# Altium project Michel.PrjPcb (part 1 of 2)
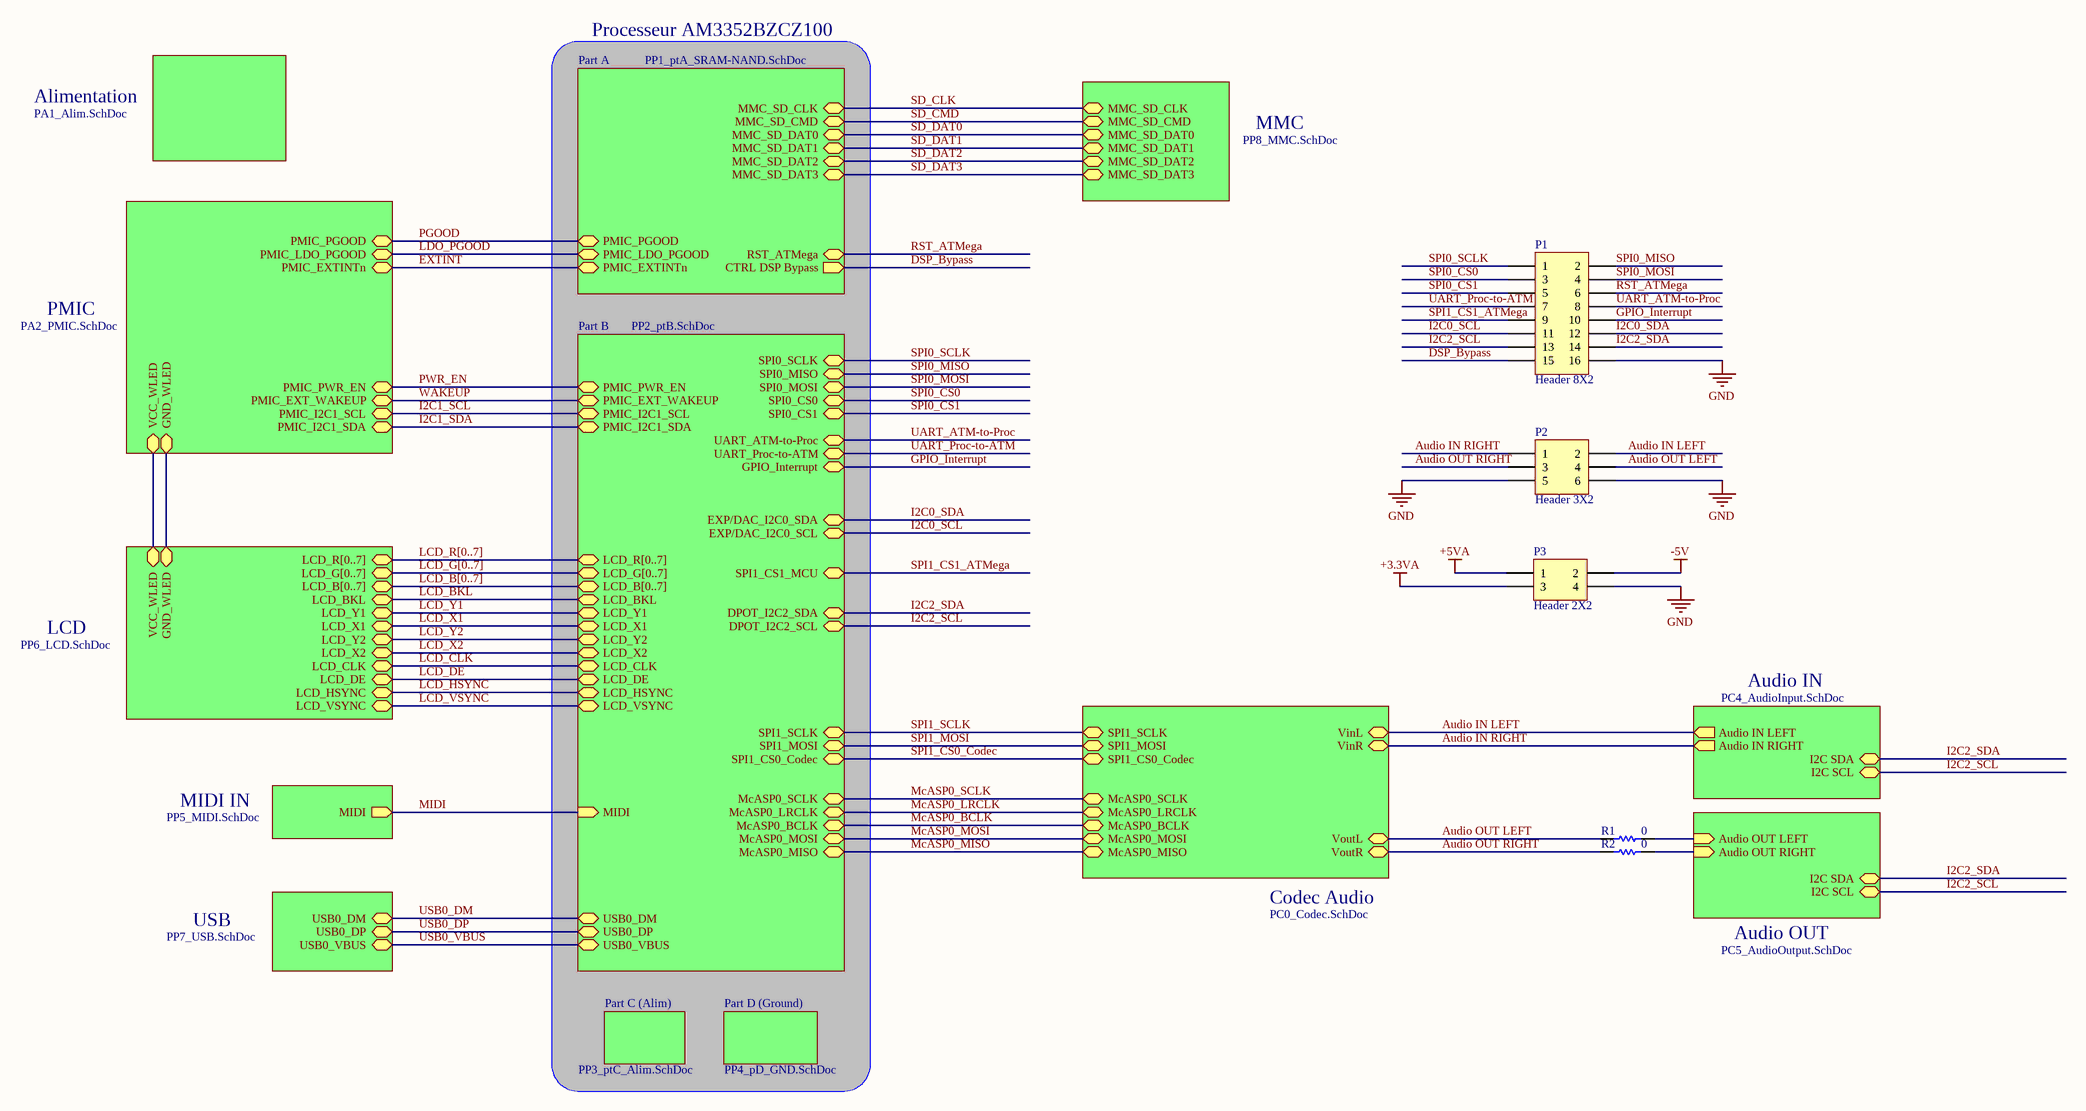
[diagram p0: P0_Main_Connect.SchDoc]
14 sheets, 392 parts. Net scope: hierarchical (ports join the sheet entries above them; power ports are global).
Board file: PCB.PcbDoc
Sheets:
  P0_Main_Connect.SchDoc
    Part A = PP1_ptA_SRAM-NAND.SchDoc
    Part B = PP2_ptB.SchDoc
    PMIC = PA2_PMIC.SchDoc
    LCD = PP6_LCD.SchDoc
    Part C (Alim) = PP3_ptC_Alim.SchDoc
    Alimentation = PA1_Alim.SchDoc
    Part D (Ground) = PP4_pD_GND.SchDoc
    MIDI IN = PP5_MIDI.SchDoc
    USB = PP7_USB.SchDoc
    MMC = PP8_MMC.SchDoc
    Audio IN = PC4_AudioInput.SchDoc
    Audio OUT = PC5_AudioOutput.SchDoc
    Codec Audio = PC0_Codec.SchDoc

## Sheet P0_Main_Connect.SchDoc
size A2

### Parts
P1  Header 8X2  [CONN_1241050-8_T]
P2  Header 3X2  [CONN_1241050-3_T]
P3  Header 2X2  [CONN_1241050-2_T]
R1  value 0  [RESC1608X05]  (hidden comment: Res 0 Ohm)
R2  value 0  [RESC1608X05]  (hidden comment: Res 0 Ohm)

### Sub-sheets
Alimentation = PA1_Alim.SchDoc: no entries
Audio IN = PC4_AudioInput.SchDoc: Audio IN RIGHT (out), Audio IN LEFT (out), I2C SCL, I2C SDA
Audio OUT = PC5_AudioOutput.SchDoc: Audio OUT RIGHT (in), Audio OUT LEFT (in), I2C SCL, I2C SDA
Codec Audio = PC0_Codec.SchDoc: SPI1_SCLK, SPI1_CS0_Codec, SPI1_MOSI, McASP0_LRCLK, McASP0_BCLK, McASP0_MOSI, McASP0_MISO, McASP0_SCLK, VoutL, VoutR, VinL, VinR
LCD = PP6_LCD.SchDoc: LCD_R[0..7], LCD_G[0..7], LCD_B[0..7], LCD_BKL, LCD_Y1, LCD_X1, LCD_Y2, LCD_X2, LCD_CLK, LCD_DE, LCD_HSYNC, LCD_VSYNC, GND_WLED, VCC_WLED
MIDI IN = PP5_MIDI.SchDoc: MIDI (out)
MMC = PP8_MMC.SchDoc: MMC_SD_CMD, MMC_SD_DAT0, MMC_SD_DAT1, MMC_SD_DAT2, MMC_SD_DAT3, MMC_SD_CLK
Part A = PP1_ptA_SRAM-NAND.SchDoc: CTRL DSP Bypass (out), RST_ATMega, MMC_SD_CLK, MMC_SD_CMD, MMC_SD_DAT0, MMC_SD_DAT1, MMC_SD_DAT2, MMC_SD_DAT3, PMIC_PGOOD, PMIC_LDO_PGOOD, PMIC_EXTINTn
Part B = PP2_ptB.SchDoc: MIDI (in), USB0_DM, USB0_DP, USB0_VBUS, SPI1_SCLK, SPI1_MOSI, SPI1_CS0_Codec, UART_ATM-to-Proc, UART_Proc-to-ATM, GPIO_Interrupt, SPI0_SCLK, SPI0_MISO, SPI0_MOSI, SPI0_CS0, SPI0_CS1, LCD_R[0..7], LCD_G[0..7], LCD_B[0..7], LCD_BKL, LCD_Y1, LCD_X1, LCD_Y2, LCD_X2, LCD_CLK, LCD_DE, LCD_HSYNC, LCD_VSYNC, PMIC_EXT_WAKEUP, PMIC_PWR_EN, PMIC_I2C1_SCL, PMIC_I2C1_SDA, SPI1_CS1_MCU, EXP/DAC_I2C0_SCL, EXP/DAC_I2C0_SDA, DPOT_I2C2_SDA, DPOT_I2C2_SCL, McASP0_LRCLK, McASP0_BCLK, McASP0_MOSI, McASP0_MISO, McASP0_SCLK
Part C (Alim) = PP3_ptC_Alim.SchDoc: no entries
Part D (Ground) = PP4_pD_GND.SchDoc: no entries
PMIC = PA2_PMIC.SchDoc: PMIC_EXT_WAKEUP, PMIC_PWR_EN, PMIC_I2C1_SCL, PMIC_I2C1_SDA, VCC_WLED, GND_WLED, PMIC_PGOOD, PMIC_LDO_PGOOD, PMIC_EXTINTn
USB = PP7_USB.SchDoc: USB0_VBUS, USB0_DP, USB0_DM

### Nets
+3.3VA: P3.3
+5VA: P3.1
-5V: P3.2
GND: P1.16 P2.5 P2.6 P3.4
Audio IN LEFT: P2.2 ; sheet Audio IN/Audio IN LEFT, sheet Codec Audio/VinL
Audio IN RIGHT: P2.1 ; sheet Audio IN/Audio IN RIGHT, sheet Codec Audio/VinR
Audio OUT LEFT: P2.4 R1.1 ; sheet Codec Audio/VoutL
Audio OUT RIGHT: P2.3 R2.1 ; sheet Codec Audio/VoutR
DSP_Bypass: P1.15 ; sheet Part A/CTRL DSP Bypass
EXTINT: sheet Part A/PMIC_EXTINTn, sheet PMIC/PMIC_EXTINTn
GPIO_Interrupt: P1.10 ; sheet Part B/GPIO_Interrupt
I2C0_SCL: P1.11 ; sheet Part B/EXP/DAC_I2C0_SCL
I2C0_SDA: P1.12 ; sheet Part B/EXP/DAC_I2C0_SDA
I2C1_SCL: sheet Part B/PMIC_I2C1_SCL, sheet PMIC/PMIC_I2C1_SCL
I2C1_SDA: sheet Part B/PMIC_I2C1_SDA, sheet PMIC/PMIC_I2C1_SDA
I2C2_SCL: P1.13 ; sheet Part B/DPOT_I2C2_SCL, sheet Audio IN/I2C SCL, sheet Audio OUT/I2C SCL
I2C2_SDA: P1.14 ; sheet Part B/DPOT_I2C2_SDA, sheet Audio IN/I2C SDA, sheet Audio OUT/I2C SDA
LCD_BKL: sheet Part B/LCD_BKL, sheet LCD/LCD_BKL
LCD_CLK: sheet Part B/LCD_CLK, sheet LCD/LCD_CLK
LCD_DE: sheet Part B/LCD_DE, sheet LCD/LCD_DE
LCD_HSYNC: sheet Part B/LCD_HSYNC, sheet LCD/LCD_HSYNC
LCD_VSYNC: sheet Part B/LCD_VSYNC, sheet LCD/LCD_VSYNC
LCD_X1: sheet Part B/LCD_X1, sheet LCD/LCD_X1
LCD_X2: sheet Part B/LCD_X2, sheet LCD/LCD_X2
LCD_Y1: sheet Part B/LCD_Y1, sheet LCD/LCD_Y1
LCD_Y2: sheet Part B/LCD_Y2, sheet LCD/LCD_Y2
LDO_PGOOD: sheet Part A/PMIC_LDO_PGOOD, sheet PMIC/PMIC_LDO_PGOOD
McASP0_BCLK: sheet Part B/McASP0_BCLK, sheet Codec Audio/McASP0_BCLK
McASP0_LRCLK: sheet Part B/McASP0_LRCLK, sheet Codec Audio/McASP0_LRCLK
McASP0_MISO: sheet Part B/McASP0_MISO, sheet Codec Audio/McASP0_MISO
McASP0_MOSI: sheet Part B/McASP0_MOSI, sheet Codec Audio/McASP0_MOSI
McASP0_SCLK: sheet Part B/McASP0_SCLK, sheet Codec Audio/McASP0_SCLK
MIDI: sheet Part B/MIDI, sheet MIDI IN/MIDI
PGOOD: sheet Part A/PMIC_PGOOD, sheet PMIC/PMIC_PGOOD
PWR_EN: sheet Part B/PMIC_PWR_EN, sheet PMIC/PMIC_PWR_EN
RST_ATMega: P1.6 ; sheet Part A/RST_ATMega
SD_CLK: sheet Part A/MMC_SD_CLK, sheet MMC/MMC_SD_CLK
SD_CMD: sheet Part A/MMC_SD_CMD, sheet MMC/MMC_SD_CMD
SD_DAT0: sheet Part A/MMC_SD_DAT0, sheet MMC/MMC_SD_DAT0
SD_DAT1: sheet Part A/MMC_SD_DAT1, sheet MMC/MMC_SD_DAT1
SD_DAT2: sheet Part A/MMC_SD_DAT2, sheet MMC/MMC_SD_DAT2
SD_DAT3: sheet Part A/MMC_SD_DAT3, sheet MMC/MMC_SD_DAT3
SPI0_CS0: P1.3 ; sheet Part B/SPI0_CS0
SPI0_CS1: P1.5 ; sheet Part B/SPI0_CS1
SPI0_MISO: P1.2 ; sheet Part B/SPI0_MISO
SPI0_MOSI: P1.4 ; sheet Part B/SPI0_MOSI
SPI0_SCLK: P1.1 ; sheet Part B/SPI0_SCLK
SPI1_CS0_Codec: sheet Part B/SPI1_CS0_Codec, sheet Codec Audio/SPI1_CS0_Codec
SPI1_CS1_ATMega: P1.9 ; sheet Part B/SPI1_CS1_MCU
SPI1_MOSI: sheet Part B/SPI1_MOSI, sheet Codec Audio/SPI1_MOSI
SPI1_SCLK: sheet Part B/SPI1_SCLK, sheet Codec Audio/SPI1_SCLK
UART_ATM-to-Proc: P1.8 ; sheet Part B/UART_ATM-to-Proc
UART_Proc-to-ATM: P1.7 ; sheet Part B/UART_Proc-to-ATM
USB0_DM: sheet Part B/USB0_DM, sheet USB/USB0_DM  [project net SB_N]
USB0_DP: sheet Part B/USB0_DP, sheet USB/USB0_DP  [project net SB_P]
USB0_VBUS: sheet Part B/USB0_VBUS, sheet USB/USB0_VBUS
WAKEUP: sheet Part B/PMIC_EXT_WAKEUP, sheet PMIC/PMIC_EXT_WAKEUP
NetC172_2: sheet PMIC/VCC_WLED, sheet LCD/VCC_WLED
NetC201_2: R2.2 ; sheet Audio OUT/Audio OUT RIGHT
NetC205_2: R1.2 ; sheet Audio OUT/Audio OUT LEFT
NetP8_1: sheet PMIC/GND_WLED, sheet LCD/GND_WLED

### Buses and harness runs
bus LCD_B[0..7] = sheet LCD/LCD_B[0..7] = sheet Part B/LCD_B[0..7]
bus LCD_G[0..7] = sheet LCD/LCD_G[0..7] = sheet Part B/LCD_G[0..7]
bus LCD_R[0..7] = sheet LCD/LCD_R[0..7] = sheet Part B/LCD_R[0..7]

### Notes on the sheet
- Processeur AM3352BZCZ100

### Library data of the parts
P1 = Header 8X2: Header, 8-Pin, Dual row; Fabricant: SAMTEC; Fournisseur: Farnell; RefFabricant: TSM-108-02-T-DV; RefFournisseur: 2856657; DataSheet: http://www.farnell.com/datasheets/318453.pdf
P2 = Header 3X2: Header, 3-Pin, Dual row; Fabricant: SAMTEC; Fournisseur: Farnell; RefFabricant: TSM-103-01-T-DV; RefFournisseur: 2505049; DataSheet: http://www.farnell.com/datasheets/318453.pdf
P3 = Header 2X2: Header, 2-Pin, Dual row; Fabricant: AMP - TE CONNECTIVITY; Fournisseur: Farnell; RefFabricant: 1241050-2; RefFournisseur: 9689559; DataSheet: http://www.farnell.com/datasheets/318453.pdf
R1 R2 = Res1: Resistor; Fabricant: VISHAY; Fournisseur: Farnell; RefFabricant: CRCW06030000Z0EB; RefFournisseur: 2616741; Case: 0603 [1608 Metric]

## Sheet PP1_ptA_SRAM-NAND.SchDoc
size 508 x 381 mm
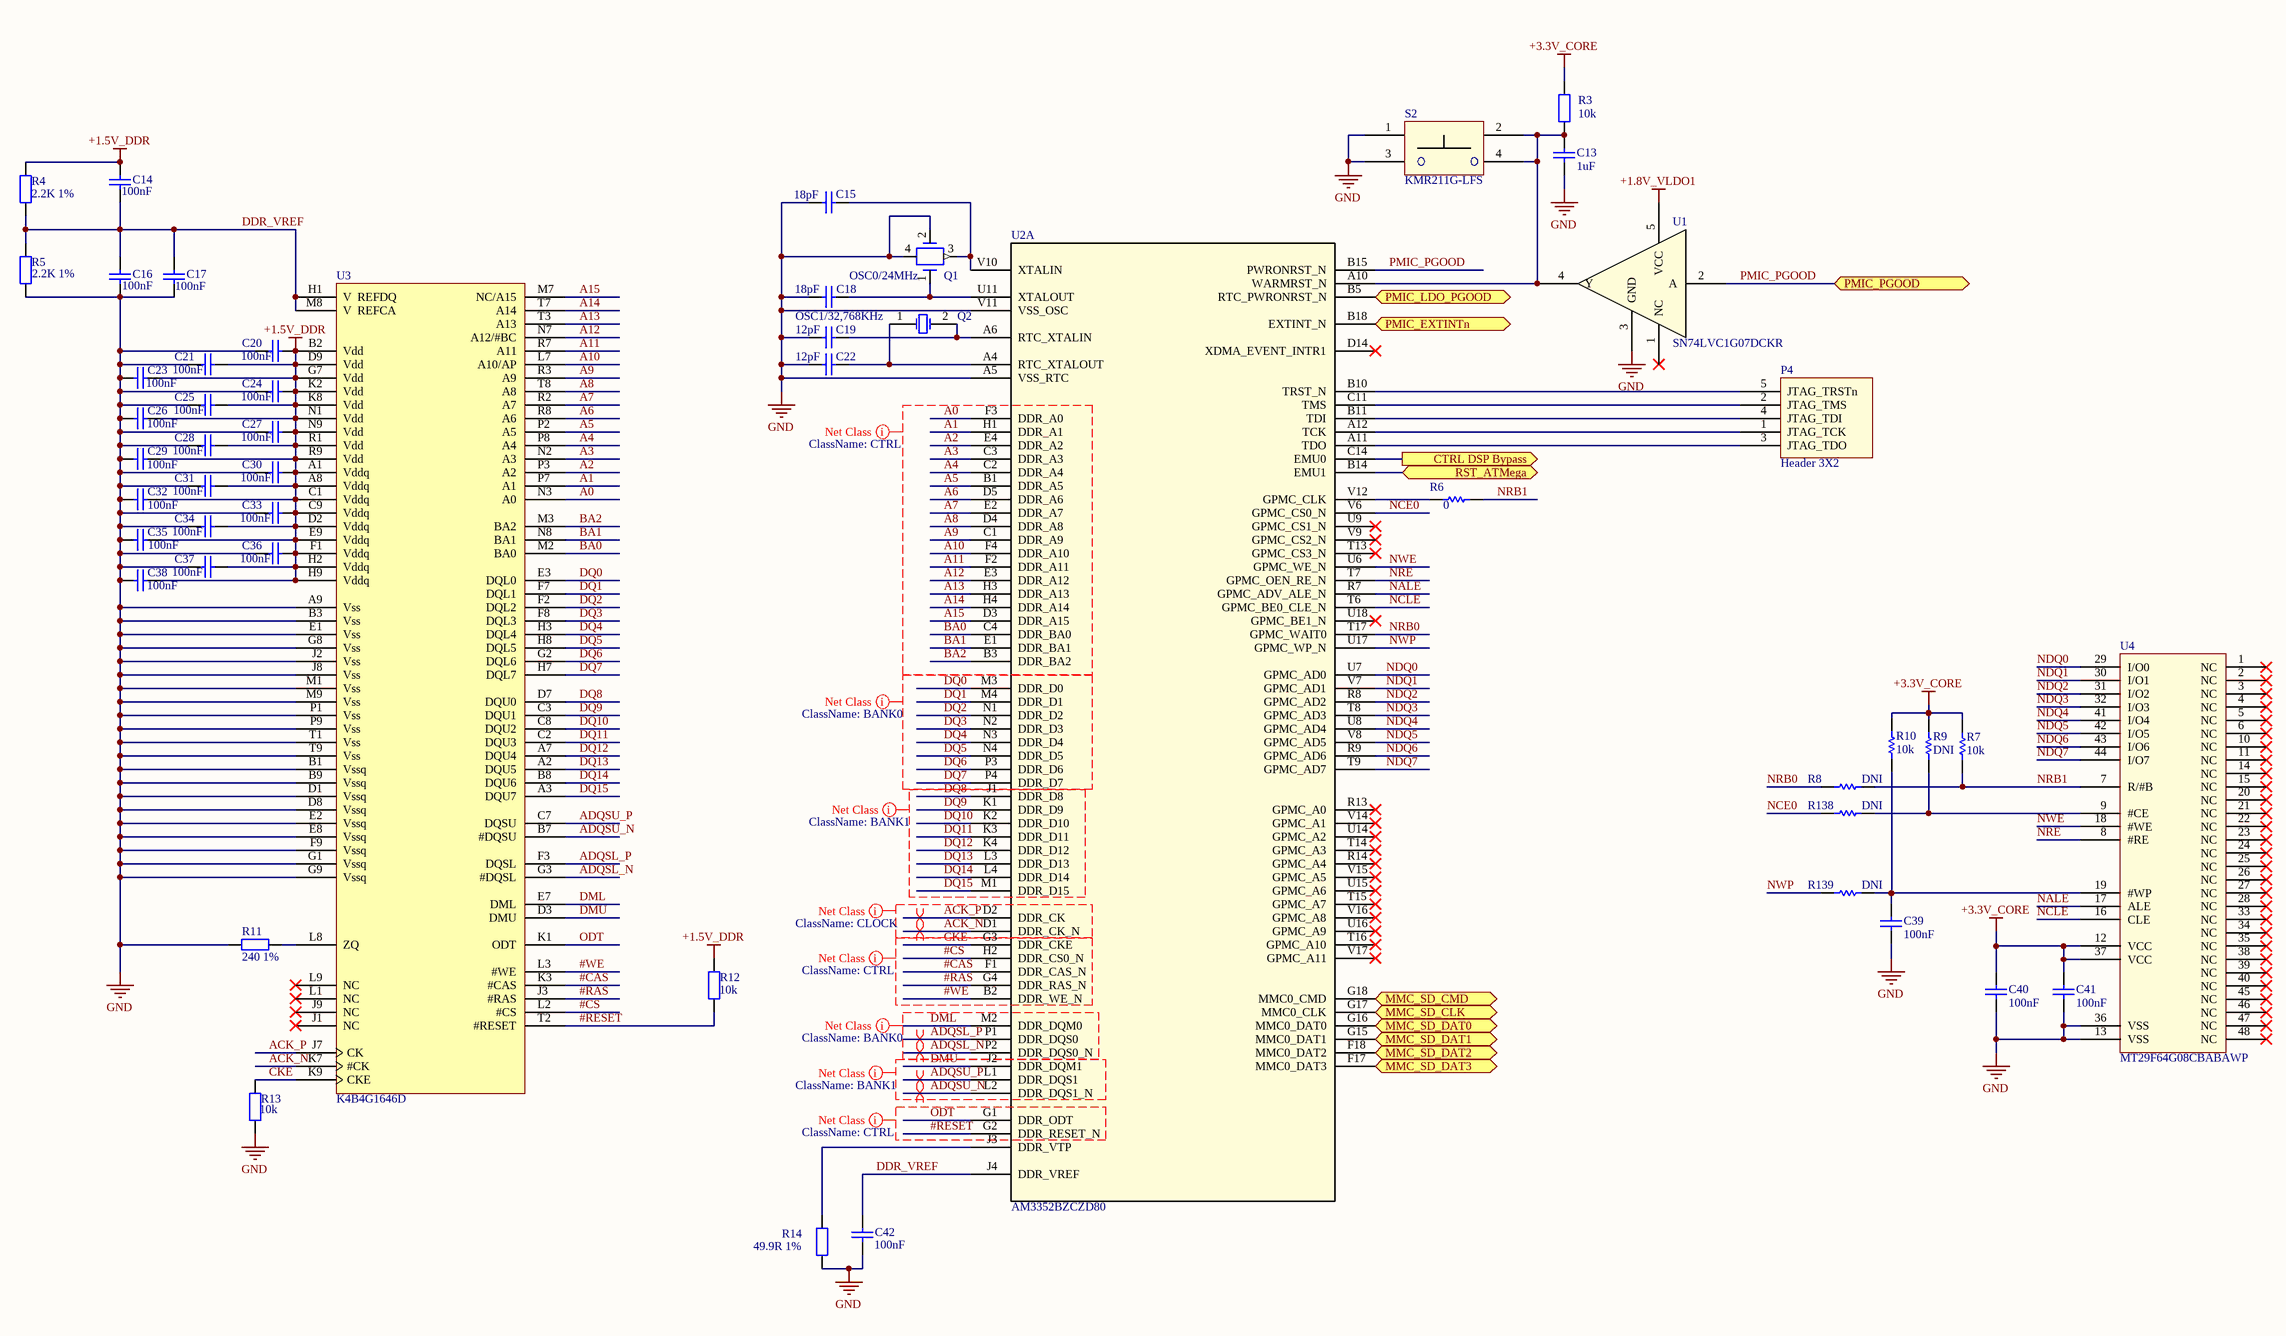
[diagram p1: PP1_ptA_SRAM-NAND.SchDoc]

### Parts
C13  value 1uF  [CAPC1608X08]  (hidden comment: Cap 1uF)
C14  value 100nF  [CAPC1005X05 (0402)]  (hidden comment: Cap 100nF)
C15  value 18pF  [CAPC1005X05 (0402)]  (hidden comment: Cap 18pF)
C16  value 100nF  [CAPC1005X05 (0402)]  (hidden comment: Cap 100nF)
C17  value 100nF  [CAPC1005X05 (0402)]  (hidden comment: Cap 100nF)
C18  value 18pF  [CAPC1005X05 (0402)]  (hidden comment: Cap 18pF)
C19  value 12pF  [CAPC1005X05 (0402)]  (hidden comment: Cap 12pF)
C20  value 100nF  [CAPC1005X05 (0402)]  (hidden comment: Cap 100nF)
C21  value 100nF  [CAPC1005X05 (0402)]  (hidden comment: Cap 100nF)
C22  value 12pF  [CAPC1005X05 (0402)]  (hidden comment: Cap 12pF)
C23  value 100nF  [CAPC1005X05 (0402)]  (hidden comment: Cap 100nF)
C24  value 100nF  [CAPC1005X05 (0402)]  (hidden comment: Cap 100nF)
C25  value 100nF  [CAPC1005X05 (0402)]  (hidden comment: Cap 100nF)
C26  value 100nF  [CAPC1005X05 (0402)]  (hidden comment: Cap 100nF)
C27  value 100nF  [CAPC1005X05 (0402)]  (hidden comment: Cap 100nF)
C28  value 100nF  [CAPC1005X05 (0402)]  (hidden comment: Cap 100nF)
C29  value 100nF  [CAPC1005X05 (0402)]  (hidden comment: Cap 100nF)
C30  value 100nF  [CAPC1005X05 (0402)]  (hidden comment: Cap 100nF)
C31  value 100nF  [CAPC1005X05 (0402)]  (hidden comment: Cap 100nF)
C32  value 100nF  [CAPC1005X05 (0402)]  (hidden comment: Cap 100nF)
C33  value 100nF  [CAPC1005X05 (0402)]  (hidden comment: Cap 100nF)
C34  value 100nF  [CAPC1005X05 (0402)]  (hidden comment: Cap 100nF)
C35  value 100nF  [CAPC1005X05 (0402)]  (hidden comment: Cap 100nF)
C36  value 100nF  [CAPC1005X05 (0402)]  (hidden comment: Cap 100nF)
C37  value 100nF  [CAPC1005X05 (0402)]  (hidden comment: Cap 100nF)
C38  value 100nF  [CAPC1005X05 (0402)]  (hidden comment: Cap 100nF)
C39  value 100nF  [CAPC1608X08]  (hidden comment: Cap 100nF)
C40  value 100nF  [CAPC1608X08]  (hidden comment: Cap 100nF)
C41  value 100nF  [CAPC1608X08]  (hidden comment: Cap 100nF)
C42  value 100nF  [CAPC1005X05 (0402)]  (hidden comment: Cap 100nF)
P4  Header 3X2  [CONN_1241050-3_T]
Q1  OSC0/24MHz  [SON440P360X120-4N]
Q2  OSC1/32,768KHz  [SON550P380X250-4N]
R3  value 10k  [RESC1608X05]  (hidden comment: Res 10k)
R4  value 2.2K 1%  [RESC1608X05]  (hidden comment: Res 2.2k)
R5  value 2.2K 1%  [RESC1608X05]  (hidden comment: Res 2.2k)
R6  value 0  [RESC1608X05]  (hidden comment: Res 0 Ohm)
R7  value 10k  [RESC1608X05]  (hidden comment: Res 10k)
R8  value DNI  [RESC1608X05]  (hidden comment: Res)  (no BOM)
R9  value DNI  [RESC1608X05]  (hidden comment: Res)  (no BOM)
R10  value 10k  [RESC1608X05]  (hidden comment: Res 10k)
R11  value 240 1%  [RESC1608X05]  (hidden comment: Res 240 1%)
R12  value 10k  [RESC1608X05]  (hidden comment: Res 10K)
R13  value 10k  [RESC1608X05]  (hidden comment: Res 10k)
R14  value 49.9R 1%  [RESC1608X05]  (hidden comment: Res 49.9R 1%)
R138  value DNI  [RESC1608X05]  (hidden comment: Res)  (no BOM)
R139  value DNI  [RESC1608X05]  (hidden comment: Res)  (no BOM)
S2  KMR211G-LFS  [C&K_KMR211G]
U1  SN74LVC1G07DCKR  [DCK5]
U2  AM3352BZCZD80  [ZCZ324]  (part A of 4)
U3  K4B4G1646D  [BGA96C80P16X6_133X75X11]
U4  MT29F64G08CBABAWP  [TSSOP50P2000X120-48N]

### Ports
CTRL DSP Bypass (out), MMC_SD_CLK, MMC_SD_CMD, MMC_SD_DAT0, MMC_SD_DAT1, MMC_SD_DAT2, MMC_SD_DAT3, PMIC_EXTINTn, PMIC_LDO_PGOOD, PMIC_PGOOD, RST_ATMega

### Nets
+1.5V_DDR: C14.2 C20.1 C21.1 C23.1 C24.1 C25.1 C26.1 C27.1 C28.1 C29.1 C30.1 C31.1 C32.1 C33.1 C34.1 C35.1 C36.1 C37.1 C38.1 R4.2 R12.2 U3.A1(Vddq) U3.A8(Vddq) U3.B2(Vdd) U3.C1(Vddq) U3.C9(Vddq) U3.D2(Vddq) U3.D9(Vdd) U3.E9(Vddq) U3.F1(Vddq) U3.G7(Vdd) U3.H2(Vddq) U3.H9(Vddq) U3.K2(Vdd) U3.K8(Vdd) U3.N1(Vdd) U3.N9(Vdd) U3.R1(Vdd) U3.R9(Vdd)
+1.8V_VLDO1: U1.5(VCC)
+3.3V_CORE: C40.2 C41.2 R3.2 R7.2 R9.2 R10.1 U4.12(VCC) U4.37(VCC)
GND: C13.1 C15.1 C16.1 C17.1 C18.1 C19.1 C20.2 C21.2 C22.1 C23.2 C24.2 C25.2 C26.2 C27.2 C28.2 C29.2 C30.2 C31.2 C32.2 C33.2 C34.2 C35.2 C36.2 C37.2 C38.2 C39.1 C40.1 C41.1 C42.2 Q1.2 Q1.4 R5.1 R11.2 R13.1 R14.1 S2.1 S2.3 U1.3(GND) U2.A5(VSS_RTC) U2.V11(VSS_OSC) U3.A9(Vss) U3.B1(Vssq) U3.B3(Vss) U3.B9(Vssq) U3.D1(Vssq) U3.D8(Vssq) U3.E1(Vss) U3.E2(Vssq) U3.E8(Vssq) U3.F9(Vssq) U3.G1(Vssq) U3.G8(Vss) U3.G9(Vssq) U3.J2(Vss) U3.J8(Vss) U3.M1(Vss) U3.M9(Vss) U3.P1(Vss) U3.P9(Vss) U3.T1(Vss) U3.T9(Vss) U4.13(VSS) U4.36(VSS)
#CAS: U2.F1(DDR_CAS_N) U3.K3(#CAS)
#CS: U2.H2(DDR_CS0_N) U3.L2(#CS)
#RAS: U2.G4(DDR_RAS_N) U3.J3(#RAS)
#RESET: R12.1 U2.G2(DDR_RESET_N) U3.T2(#RESET)
#WE: U2.B2(DDR_WE_N) U3.L3(#WE)
A0: U2.F3(DDR_A0) U3.N3(A0)
A1: U2.H1(DDR_A1) U3.P7(A1)
A2: U2.E4(DDR_A2) U3.P3(A2)
A3: U2.C3(DDR_A3) U3.N2(A3)
A4: U2.C2(DDR_A4) U3.P8(A4)
A5: U2.B1(DDR_A5) U3.P2(A5)
A6: U2.D5(DDR_A6) U3.R8(A6)
A7: U2.E2(DDR_A7) U3.R2(A7)
A8: U2.D4(DDR_A8) U3.T8(A8)
A9: U2.C1(DDR_A9) U3.R3(A9)
A10: U2.F4(DDR_A10) U3.L7(A10/AP)
A11: U2.F2(DDR_A11) U3.R7(A11)
A12: U2.E3(DDR_A12) U3.N7(A12/#BC)
A13: U2.H3(DDR_A13) U3.T3(A13)
A14: U2.H4(DDR_A14) U3.T7(A14)
A15: U2.D3(DDR_A15) U3.M7(NC/A15)
ACK_N: U2.D1(DDR_CK_N) U3.K7(#CK)
ACK_P: U2.D2(DDR_CK) U3.J7(CK)
ADQSL_N: U2.P2(DDR_DQS0_N) U3.G3(#DQSL)
ADQSL_P: U2.P1(DDR_DQS0) U3.F3(DQSL)
ADQSU_N: U2.L2(DDR_DQS1_N) U3.B7(#DQSU)
ADQSU_P: U2.L1(DDR_DQS1) U3.C7(DQSU)
BA0: U2.C4(DDR_BA0) U3.M2(BA0)
BA1: U2.E1(DDR_BA1) U3.N8(BA1)
BA2: U2.B3(DDR_BA2) U3.M3(BA2)
CKE: R13.2 U2.G3(DDR_CKE) U3.K9(CKE)
DDR_VREF: C14.1 C16.2 C17.2 C42.1 R4.1 R5.2 U2.J4(DDR_VREF) U3.H1(V__REFDQ) U3.M8(V__REFCA)
DML: U2.M2(DDR_DQM0) U3.E7(DML)
DMU: U2.J2(DDR_DQM1) U3.D3(DMU)
DQ0: U2.M3(DDR_D0) U3.E3(DQL0)
DQ1: U2.M4(DDR_D1) U3.F7(DQL1)
DQ2: U2.N1(DDR_D2) U3.F2(DQL2)
DQ3: U2.N2(DDR_D3) U3.F8(DQL3)
DQ4: U2.N3(DDR_D4) U3.H3(DQL4)
DQ5: U2.N4(DDR_D5) U3.H8(DQL5)
DQ6: U2.P3(DDR_D6) U3.G2(DQL6)
DQ7: U2.P4(DDR_D7) U3.H7(DQL7)
DQ8: U2.J1(DDR_D8) U3.D7(DQU0)
DQ9: U2.K1(DDR_D9) U3.C3(DQU1)
DQ10: U2.K2(DDR_D10) U3.C8(DQU2)
DQ11: U2.K3(DDR_D11) U3.C2(DQU3)
DQ12: U2.K4(DDR_D12) U3.A7(DQU4)
DQ13: U2.L3(DDR_D13) U3.A2(DQU5)
DQ14: U2.L4(DDR_D14) U3.B8(DQU6)
DQ15: U2.M1(DDR_D15) U3.A3(DQU7)
DSP_Bypass: U2.C14(EMU0) ; port CTRL DSP Bypass
EXTINT: U2.B18(EXTINT_N) ; port PMIC_EXTINTn
LDO_PGOOD: U2.B5(RTC_PWRONRST_N) ; port PMIC_LDO_PGOOD
NALE: U2.R7(GPMC_ADV_ALE_N) U4.17(ALE)
NCE0: R138.1 U2.V6(GPMC_CS0_N)
NCLE: U2.T6(GPMC_BE0_CLE_N) U4.16(CLE)
NDQ0: U2.U7(GPMC_AD0) U4.29(I/O0)
NDQ1: U2.V7(GPMC_AD1) U4.30(I/O1)
NDQ2: U2.R8(GPMC_AD2) U4.31(I/O2)
NDQ3: U2.T8(GPMC_AD3) U4.32(I/O3)
NDQ4: U2.U8(GPMC_AD4) U4.41(I/O4)
NDQ5: U2.V8(GPMC_AD5) U4.42(I/O5)
NDQ6: U2.R9(GPMC_AD6) U4.43(I/O6)
NDQ7: U2.T9(GPMC_AD7) U4.44(I/O7)
NRB0: R8.1 U2.T17(GPMC_WAIT0)
NRB1: R6.2 R7.1 R8.2 U4.7(R/#B)
NRE: U2.T7(GPMC_OEN_RE_N) U4.8(#RE)
NWE: U2.U6(GPMC_WE_N) U4.18(#WE)
NWP: R139.1 U2.U17(GPMC_WP_N)
ODT: U2.G1(DDR_ODT) U3.K1(ODT)
PMIC_PGOOD: U1.2(A) U2.B15(PWRONRST_N) ; port PMIC_PGOOD  [project net PGOOD]
RST_ATMega: U2.B14(EMU1) ; port RST_ATMega
SD_CLK: U2.G17(MMC0_CLK) ; port MMC_SD_CLK
SD_CMD: U2.G18(MMC0_CMD) ; port MMC_SD_CMD
SD_DAT0: U2.G16(MMC0_DAT0) ; port MMC_SD_DAT0
SD_DAT1: U2.G15(MMC0_DAT1) ; port MMC_SD_DAT1
SD_DAT2: U2.F18(MMC0_DAT2) ; port MMC_SD_DAT2
SD_DAT3: U2.F17(MMC0_DAT3) ; port MMC_SD_DAT3
NetC13_2: C13.2 R3.1 S2.2 S2.4 U1.4(Y) U2.A10(WARMRST_N)
NetC15_2: C15.2 Q1.3 U2.V10(XTALIN)
NetC18_2: C18.2 Q1.1 U2.U11(XTALOUT)
NetC19_2: C19.2 Q2.2(OSC2) U2.A6(RTC_XTALIN)
NetC22_2: C22.2 Q2.1(OSC1) U2.A4(RTC_XTALOUT)
NetC39_2: C39.2 R10.2 R139.2 U4.19(#WP)
NetP4_1: P4.1(JTAG_TCK) U2.A12(TCK)
NetP4_2: P4.2(JTAG_TMS) U2.C11(TMS)
NetP4_3: P4.3(JTAG_TDO) U2.A11(TDO)
NetP4_4: P4.4(JTAG_TDI) U2.B11(TDI)
NetP4_5: P4.5(JTAG_TRSTn) U2.B10(TRST_N)
NetR6_1: R6.1 U2.V12(GPMC_CLK)
NetR9_1: R9.1 R138.2 U4.9(#CE)
NetR11_1: R11.1 U3.L8(ZQ)
NetR14_2: R14.2 U2.J3(DDR_VTP)

Not connected (* = marked no-connect by the designer): U1 1(NC)*; U2 D14(XDMA_EVENT_INTR1)* R13(GPMC_A0)* R14(GPMC_A4)* T13(GPMC_CS3_N)* T14(GPMC_A3)* T15(GPMC_A7)* T16(GPMC_A10)* U9(GPMC_CS1_N)* U14(GPMC_A2)* U15(GPMC_A6)* U16(GPMC_A9)* U18(GPMC_BE1_N)* V9(GPMC_CS2_N)* V14(GPMC_A1)* V15(GPMC_A5)* V16(GPMC_A8)* V17(GPMC_A11)*; U3 J1(NC)* J9(NC)* L1(NC)* L9(NC)*; U4 1(NC)* 2(NC)* 3(NC)* 4(NC)* 5(NC)* 6(NC)* 10(NC)* 11(NC)* 14(NC)* 15(NC)* 20(NC)* 21(NC)* 22(NC)* 23(NC)* 24(NC)* 25(NC)* 26(NC)* 27(NC)* 28(NC)* 33(NC)* 34(NC)* 35(NC)* 38(NC)* 39(NC)* 40(NC)* 45(NC)* 46(NC)* 47(NC)* 48(NC)*

### Layout directives
differential pair; net class DIFF100: ACK_N, ACK_P, ADQSL_N, ADQSL_P, ADQSU_N, ADQSU_P
net class CTRL: #CAS, #CS, #RAS, #RESET, #WE, A0, A1, A2, A3, A4, A5, A6, A7, A8, A9, A10, A11, A12, A13, A14, A15, BA0, BA1, BA2, CKE, ODT
net class BANK0: DML, DQ0, DQ1, DQ2, DQ3, DQ4, DQ5, DQ6, DQ7
net class CLOCK: ACK_N, ACK_P
net class BANK1: ADQSU_N, ADQSU_P, DMU, DQ8, DQ9, DQ10, DQ11, DQ12, DQ13, DQ14, DQ15

### Notes on the sheet
- Title
- Size:
- Date:
- A3
- Number:
- Time:
- Revision:
- Sheet
- of
- File:

### Library data of the parts
C13 = Cap: Capacitor; Fabricant: MURATA; Fournisseur: Farnell; RefFabricant: GRM188F51A105ZA01D; RefFournisseur: 1828847; Case: 0603 [1608 Metric]; DataSheet: http://www.farnell.com/datasheets/2048756.pdf
C14 C16 C17 C20 C21 C23-C38 C42 = Cap: Capacitor; Fabricant: MULTICOMP; Fournisseur: Farnell; RefFabricant: MC0402N101J160CT; RefFournisseur: 2627387; Case: 0402 [1005 Metric]; DataSheet: http://www.farnell.com/datasheets/2117933.pdf
C15 C18 = Cap: Capacitor; Fabricant: MURATA; Fournisseur: Farnell; RefFabricant: GRM1555C1H180FA01D; RefFournisseur: 2611892; Case: 0402 [1005 Metric]; DataSheet: http://www.farnell.com/datasheets/2048029.pdf
C19 C22 = Cap: Capacitor; Fabricant: MURATA; Fournisseur: Farnell; RefFabricant: GRM1555C1H120FA01D; RefFournisseur: 2611890; Case: 0402 [1005 Metric]; DataSheet: http://www.farnell.com/datasheets/2079134.pdf
C39-C41 = Cap Semi: Capacitor; Fabricant: KEMET; Fournisseur: Farnell; RefFabricant: C0603T104K5RALTU; RefFournisseur: 2522432; Case: 0603 [1608 Metric]
P4 = JTAG: Header, 3-Pin, Dual row; Fournisseur: Farnell; RefFournisseur: 2505049; Fabricant: SAMTEC; RefFabricant: TSM-103-01-T-DV; DataSheet: http://www.farnell.com/datasheets/318453.pdf
Q1 = CRYS_32_768KHz_CMS32: Quartz 24MHz; RefFournisseur: 2467855; Fournisseur: Farnell; Fabricant: ABRACON; RefFabricant: ABMM2-24.000MHZ-E2-T; DataSheet: http://www.farnell.com/datasheets/1750519.pdf; Value: 24MHz
Q2 = XTAL: Crystal Oscillator; Fabricant: IQD FREQUENCY PRODUCTS; Fournisseur: Farnell; RefFabricant: LFXTAL003000; RefFournisseur: 9713220; Value: 32,768KHz; DataSheet: http://www.farnell.com/datasheets/2175893.pdf
R3 R12 R13 = Res2: Resistor; Fabricant: TE CONNECTIVITY; Fournisseur: Farnell; RefFabricant: CRGH0603J10K; RefFournisseur: 2331740; Case: 0603 [1608 Metric]; DataSheet: CRGH0603J10K
R4 R5 = Res2: Resistor; Fabricant: TE CONNECTIVITY; Fournisseur: Farnell; RefFabricant: CRGH0603F2K2; RefFournisseur: 2332007; Case: 0603 [1608 Metric]
R6 = Res1: as R1 on sheet P0_Main_Connect; Case: 0603 [1608 Metric]
R7 R10 = Res1: Resistor; Fabricant: TE CONNECTIVITY; Fournisseur: Farnell; RefFabricant: CRGH0603J10K; RefFournisseur: 2331740; Case: 0603 [1608 Metric]; DataSheet: CRGH0603J10K
R8 R9 R138 R139 = Res1: Resistor; Case: 0603 [1608 Metric]
R11 = Res2: Resistor; Fabricant: TE CONNECTIVITY; Fournisseur: Farnell; RefFabricant: CPF0603B240RE1; RefFournisseur: 2331060; Case: 0603 [1608 Metric]
R14 = Res2: Resistor; Fabricant: TE CONNECTIVITY; Fournisseur: Farnell; RefFabricant: RN73C1J49R9BTDF; RefFournisseur: 2613729; Case: 0603 [1608 Metric]
S2 = KMR211G-LFS: Commutateur tactile; Fournisseur: Farnell; RefFournisseur: 1437635; RefFabricant: KMR211G LFS; Fabricant: C & K COMPONENTS; DataSheet: http://www.farnell.com/datasheets/2044619.pdf
U1 = SN74LVC1G07DCKR: Buffers & Transmetteurs; RefFournisseur: 1287544; Fabricant: TEXAS INSTRUMENTS; Fournisseur: Farnell; RefFabricant: SN74LVC1G07DCKR; DataSheet: http://www.ti.com/lit/ds/symlink/sn74lvc1g07.pdf
U2 = AM3352BZCZD80: Microprocesseur ARM; Fabricant: TEXAS INSTRUMENTS; Fournisseur: Olimex; RefFabricant: AM3352ZCZD72; RefFournisseur: AM3352ZCZD72; DataSheet: http://www.ti.com/lit/ds/symlink/am3352.pdf
U3 = K4B4G1646D: Mémoire DDR3/SRAM; Fabricant: Samsung; Fournisseur: Olimex; RefFabricant: DS_K4B4G1646D; RefFournisseur: K4B4G1646D-BCK0; DataSheet: http://www.samsung.com/global/business/semiconductor/file/product/DS_K4B4G1646D-BC_I_P_Rev102.pdf
U4 = MT29F64G08CBABAWP: Mémoire Flash/NAND; Fournisseur: Olimex; Fabricant: Hynix; RefFabricant: MT29F64G08CBABAWP; RefFournisseur: MT29F64G08CBABAWP; DataSheet: https://www.olimex.com/Products/Components/IC/H27UBG8T2BTR/resources/H27UBG8T2BTR.pdf

## Sheet PP2_ptB.SchDoc
size 254 x 254 mm
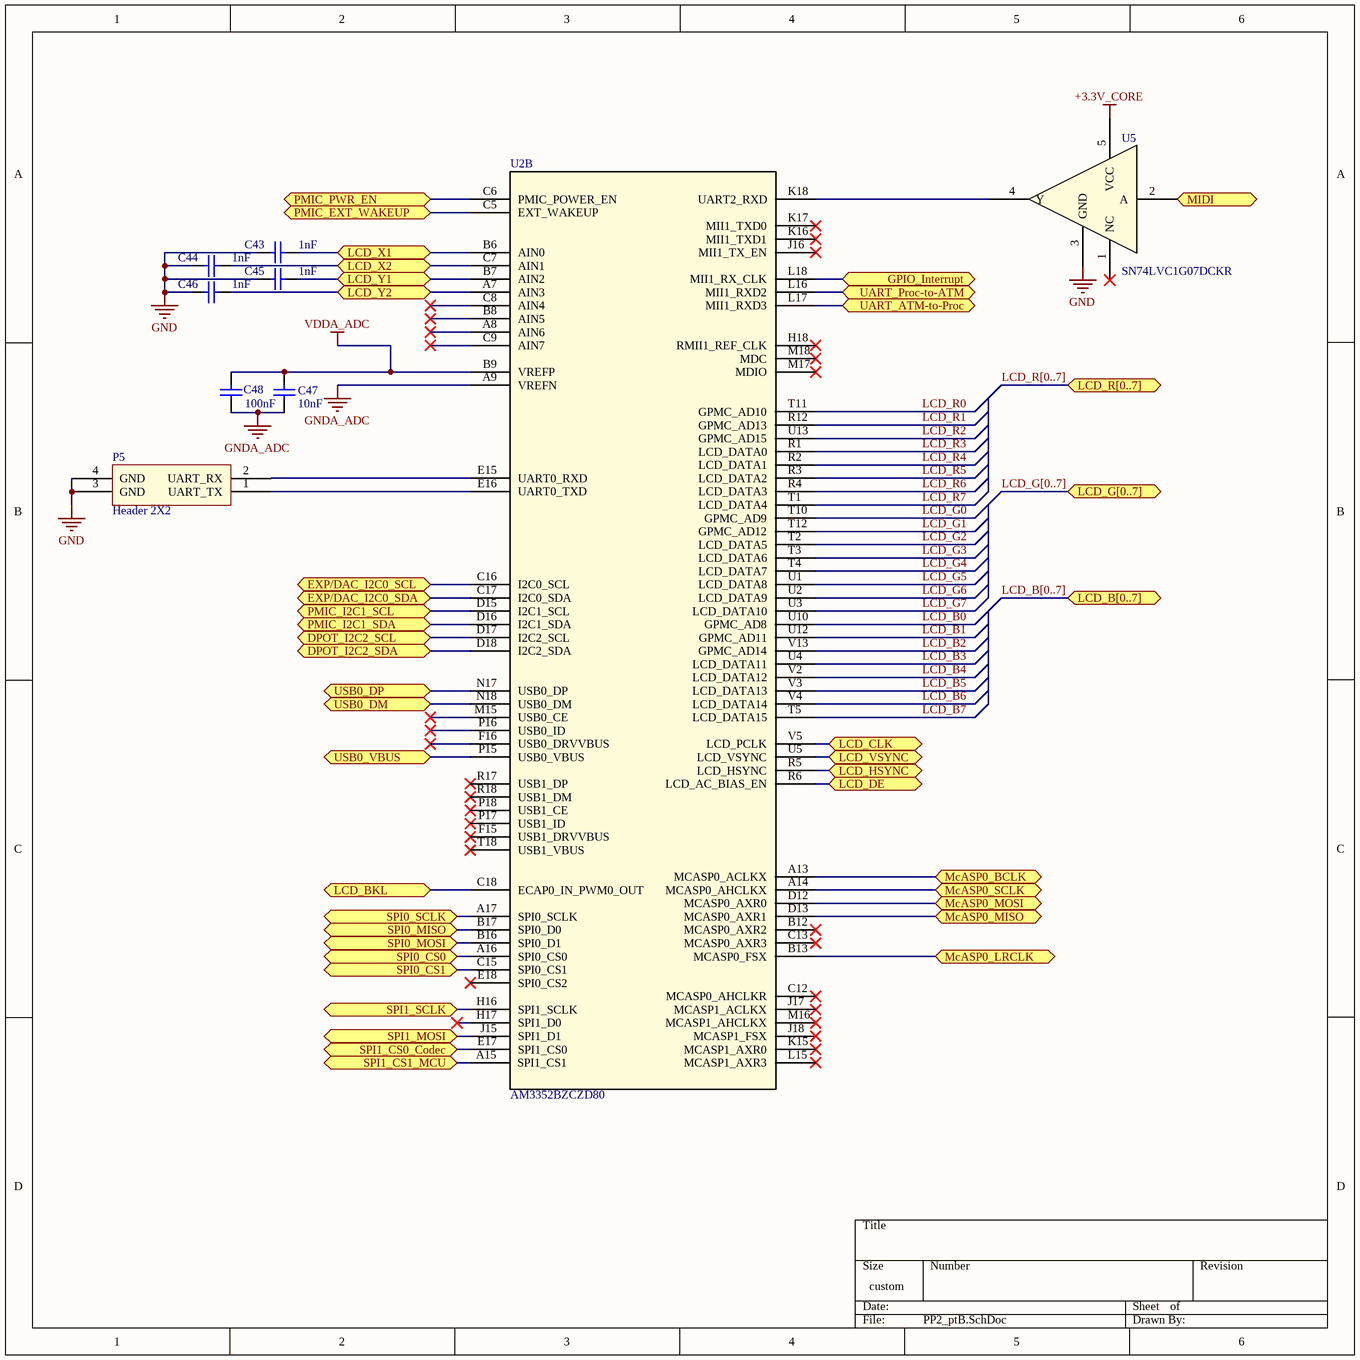
[diagram p2: PP2_ptB.SchDoc]

### Parts
C43  value 1nF  [CAPC1608X08]  (hidden comment: Cap 1nF)
C44  value 1nF  [CAPC1608X08]  (hidden comment: Cap 1nF)
C45  value 1nF  [CAPC1608X08]  (hidden comment: Cap 1nF)
C46  value 1nF  [CAPC1608X08]  (hidden comment: Cap 1nF)
C47  value 10nF  [CAPC1005X05 (0402)]  (hidden comment: Cap 10uF)
C48  value 100nF  [CAPC1005X05 (0402)]  (hidden comment: Cap 100nF)
P5  Header 2X2  [CONN_1241050-2_T]
U2  AM3352BZCZD80  [ZCZ324]  (part B of 4)
U5  SN74LVC1G07DCKR  [DCK5]

### Ports
DPOT_I2C2_SCL, DPOT_I2C2_SDA, EXP/DAC_I2C0_SCL, EXP/DAC_I2C0_SDA, GPIO_Interrupt, LCD_B[0..7], LCD_BKL, LCD_CLK, LCD_DE, LCD_G[0..7], LCD_HSYNC, LCD_R[0..7], LCD_VSYNC, LCD_X1, LCD_X2, LCD_Y1, LCD_Y2, McASP0_BCLK, McASP0_LRCLK, McASP0_MISO, McASP0_MOSI, McASP0_SCLK, MIDI (in), PMIC_EXT_WAKEUP, PMIC_I2C1_SCL, PMIC_I2C1_SDA, PMIC_PWR_EN, SPI0_CS0, SPI0_CS1, SPI0_MISO, SPI0_MOSI, SPI0_SCLK, SPI1_CS0_Codec, SPI1_CS1_MCU, SPI1_MOSI, SPI1_SCLK, UART_ATM-to-Proc, UART_Proc-to-ATM, USB0_DM, USB0_DP, USB0_VBUS

### Nets
+3.3V_CORE: U5.5(VCC)
GND: C43.1 C44.1 C45.1 C46.1 P5.3(GND) P5.4(GND) U5.3(GND)
GNDA_ADC: C47.2 C48.2 U2.A9(VREFN)
VDDA_ADC: C47.1 C48.1 U2.B9(VREFP)
GPIO_Interrupt: U2.L18(MII1_RX_CLK) ; port GPIO_Interrupt
I2C0_SCL: U2.C16(I2C0_SCL) ; port EXP/DAC_I2C0_SCL
I2C0_SDA: U2.C17(I2C0_SDA) ; port EXP/DAC_I2C0_SDA
I2C1_SCL: U2.D15(I2C1_SCL) ; port PMIC_I2C1_SCL
I2C1_SDA: U2.D16(I2C1_SDA) ; port PMIC_I2C1_SDA
I2C2_SCL: U2.D17(I2C2_SCL) ; port DPOT_I2C2_SCL
I2C2_SDA: U2.D18(I2C2_SDA) ; port DPOT_I2C2_SDA
LCD_B0: U2.U10(GPMC_AD8)
LCD_B1: U2.U12(GPMC_AD11)
LCD_B2: U2.V13(GPMC_AD14)
LCD_B3: U2.U4(LCD_DATA11)
LCD_B4: U2.V2(LCD_DATA12)
LCD_B5: U2.V3(LCD_DATA13)
LCD_B6: U2.V4(LCD_DATA14)
LCD_B7: U2.T5(LCD_DATA15)
LCD_BKL: U2.C18(ECAP0_IN_PWM0_OUT) ; port LCD_BKL
LCD_CLK: U2.V5(LCD_PCLK) ; port LCD_CLK
LCD_DE: U2.R6(LCD_AC_BIAS_EN) ; port LCD_DE
LCD_G0: U2.T10(GPMC_AD9)
LCD_G1: U2.T12(GPMC_AD12)
LCD_G2: U2.T2(LCD_DATA5)
LCD_G3: U2.T3(LCD_DATA6)
LCD_G4: U2.T4(LCD_DATA7)
LCD_G5: U2.U1(LCD_DATA8)
LCD_G6: U2.U2(LCD_DATA9)
LCD_G7: U2.U3(LCD_DATA10)
LCD_HSYNC: U2.R5(LCD_HSYNC) ; port LCD_HSYNC
LCD_R0: U2.T11(GPMC_AD10)
LCD_R1: U2.R12(GPMC_AD13)
LCD_R2: U2.U13(GPMC_AD15)
LCD_R3: U2.R1(LCD_DATA0)
LCD_R4: U2.R2(LCD_DATA1)
LCD_R5: U2.R3(LCD_DATA2)
LCD_R6: U2.R4(LCD_DATA3)
LCD_R7: U2.T1(LCD_DATA4)
LCD_VSYNC: U2.U5(LCD_VSYNC) ; port LCD_VSYNC
LCD_X1: C43.2 U2.B6(AIN0) ; port LCD_X1
LCD_X2: C44.2 U2.C7(AIN1) ; port LCD_X2
LCD_Y1: C45.2 U2.B7(AIN2) ; port LCD_Y1
LCD_Y2: C46.2 U2.A7(AIN3) ; port LCD_Y2
McASP0_BCLK: U2.A13(MCASP0_ACLKX) ; port McASP0_BCLK
McASP0_LRCLK: U2.B13(MCASP0_FSX) ; port McASP0_LRCLK
McASP0_MISO: U2.D13(MCASP0_AXR1) ; port McASP0_MISO
McASP0_MOSI: U2.D12(MCASP0_AXR0) ; port McASP0_MOSI
McASP0_SCLK: U2.A14(MCASP0_AHCLKX) ; port McASP0_SCLK
MIDI: U5.2(A) ; port MIDI
PWR_EN: U2.C6(PMIC_POWER_EN) ; port PMIC_PWR_EN
SB_N: U2.N18(USB0_DM) ; port USB0_DM
SB_P: U2.N17(USB0_DP) ; port USB0_DP
SPI0_CS0: U2.A16(SPI0_CS0) ; port SPI0_CS0
SPI0_CS1: U2.C15(SPI0_CS1) ; port SPI0_CS1
SPI0_MISO: U2.B17(SPI0_D0) ; port SPI0_MISO
SPI0_MOSI: U2.B16(SPI0_D1) ; port SPI0_MOSI
SPI0_SCLK: U2.A17(SPI0_SCLK) ; port SPI0_SCLK
SPI1_CS0_Codec: U2.E17(SPI1_CS0) ; port SPI1_CS0_Codec
SPI1_CS1_ATMega: U2.A15(SPI1_CS1) ; port SPI1_CS1_MCU
SPI1_MOSI: U2.J15(SPI1_D1) ; port SPI1_MOSI
SPI1_SCLK: U2.H16(SPI1_SCLK) ; port SPI1_SCLK
UART_ATM-to-Proc: U2.L17(MII1_RXD3) ; port UART_ATM-to-Proc
UART_Proc-to-ATM: U2.L16(MII1_RXD2) ; port UART_Proc-to-ATM
USB0_VBUS: U2.P15(USB0_VBUS) ; port USB0_VBUS
WAKEUP: U2.C5(EXT_WAKEUP) ; port PMIC_EXT_WAKEUP
NetP5_1: P5.1(UART_TX) U2.E16(UART0_TXD)
NetP5_2: P5.2(UART_RX) U2.E15(UART0_RXD)
NetU2_K18: U2.K18(UART2_RXD) U5.4(Y)

Not connected (* = marked no-connect by the designer): U2 A8(AIN6)* B8(AIN5)* B12(MCASP0_AXR2)* C8(AIN4)* C9(AIN7)* C12(MCASP0_AHCLKR)* C13(MCASP0_AXR3)* E18(SPI0_CS2)* F15(USB1_DRVVBUS)* F16(USB0_DRVVBUS)* H17(SPI1_D0)* H18(RMII1_REF_CLK)* J16(MII1_TX_EN)* J17(MCASP1_ACLKX)* J18(MCASP1_FSX)* K15(MCASP1_AXR0)* K16(MII1_TXD1)* K17(MII1_TXD0)* L15(MCASP1_AXR3)* M15(USB0_CE)* M16(MCASP1_AHCLKX)* M17(MDIO)* M18(MDC)* P16(USB0_ID)* P17(USB1_ID)* P18(USB1_CE)* R17(USB1_DP)* R18(USB1_DM)* T18(USB1_VBUS)*; U5 1(NC)*

### Buses and harness runs
bus LCD_B[0..7] = port LCD_B[0..7]
bus LCD_G[0..7] = port LCD_G[0..7]
bus LCD_R[0..7] = port LCD_R[0..7]

### Library data of the parts
C43-C46 = Cap: Capacitor; Fabricant: MURATA; Fournisseur: Farnell; RefFabricant: GRT1885C1H102JA02D; RefFournisseur: 2672134; Case: 0603 [1608 Metric]; DataSheet: http://www.farnell.com/datasheets/2165937.pdf
C47 = Cap: Capacitor; Fabricant: TDK; Fournisseur: Farnell; RefFabricant: C1005X8R1E103K050BA; RefFournisseur: 2525066; Case: 0402 [1005 Metric]; DataSheet: http://www.farnell.com/datasheets/1936795.pdf
C48 = Cap: as C14 on sheet PP1_ptA_SRAM-NAND; Case: 0402 [1005 Metric]; DataSheet: http://www.farnell.com/datasheets/2117933.pdf
P5 = UART: Header, 2-Pin, Dual row; Fournisseur: Farnell; RefFournisseur: 9689559; Fabricant: AMP - TE CONNECTIVITY; RefFabricant: 1241050-2; DataSheet: http://www.farnell.com/datasheets/318453.pdf
U2 = AM3352BZCZD80: as U2 on sheet PP1_ptA_SRAM-NAND; RefFournisseur: AM3352ZCZD72; DataSheet: http://www.ti.com/lit/ds/symlink/am3352.pdf
U5 = SN74LVC1G07DCKR: as U1 on sheet PP1_ptA_SRAM-NAND; RefFabricant: SN74LVC1G07DCKR; DataSheet: http://www.ti.com/lit/ds/symlink/sn74lvc1g07.pdf

## Sheet PA2_PMIC.SchDoc
size A3
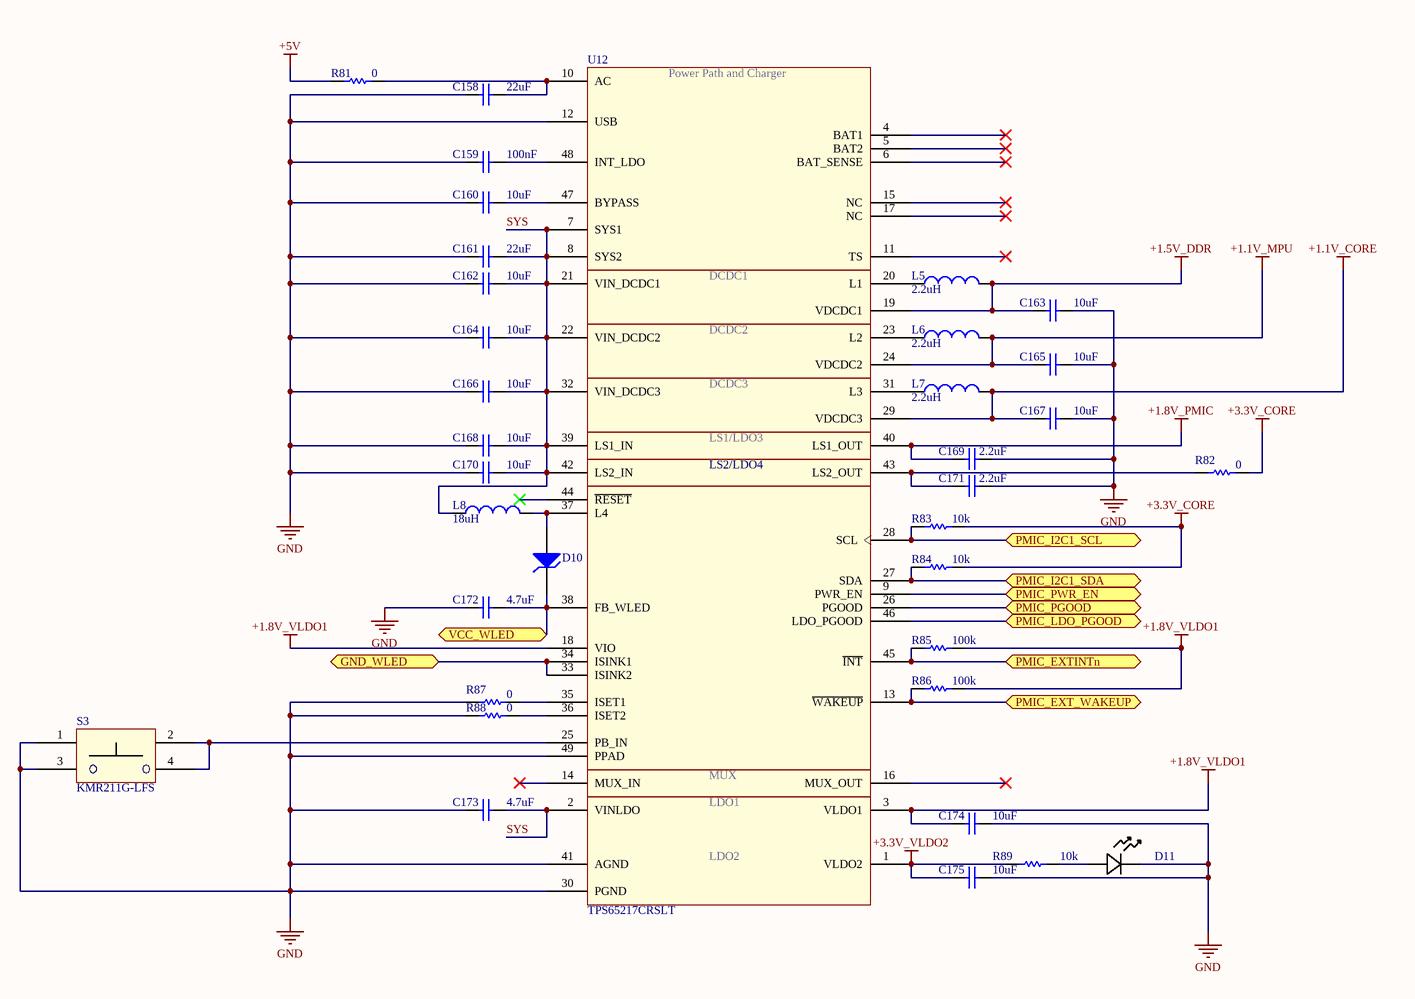
[diagram p3: PA2_PMIC.SchDoc]

### Parts
C158  value 22uF  [CAPC1608X08]  (hidden comment: Cap 22uF)
C159  value 100nF  [CAPC1608X08]  (hidden comment: Cap 100nF)
C160  value 10uF  [CAPC1608X08]  (hidden comment: Cap 10uF)
C161  value 22uF  [CAPC1608X08]  (hidden comment: Cap 22uF)
C162  value 10uF  [CAPC1608X08]  (hidden comment: Cap 10uF)
C163  value 10uF  [CAPC1608X08]  (hidden comment: Cap 10uF)
C164  value 10uF  [CAPC1608X08]  (hidden comment: Cap 10uF)
C165  value 10uF  [CAPC1608X08]  (hidden comment: Cap 10uF)
C166  value 10uF  [CAPC1608X08]  (hidden comment: Cap 10uF)
C167  value 10uF  [CAPC1608X08]  (hidden comment: Cap 10uF)
C168  value 10uF  [CAPC1608X08]  (hidden comment: Cap 10uF)
C169  value 2.2uF  [CAPC1608X08]  (hidden comment: Cap 2.2uF)
C170  value 10uF  [CAPC1608X08]  (hidden comment: Cap 10uF)
C171  value 2.2uF  [CAPC1608X08]  (hidden comment: Cap 2.2uF)
C172  value 4.7uF  [CAPC1608X08]  (hidden comment: Cap 4.7uF)
C173  value 4.7uF  [CAPC1608X08]  (hidden comment: Cap 4.7uF)
C174  value 10uF  [CAPC1608X08]  (hidden comment: Cap 10uF)
C175  value 10uF  [CAPC1608X08]  (hidden comment: Cap 10uF)
D10  D Zener  [MF03A-M]  (value not drawn)
D11  Blanc  [LED_LNJ]  (value not drawn)
L5  value 2.2uH  [INDM1608X08N]  (hidden comment: Inductor)
L6  value 2.2uH  [INDM1608X08N]  (hidden comment: Inductor)
L7  value 2.2uH  [INDM1608X08N]  (hidden comment: Inductor)
L8  value 18uH  [INDM2612X12N]  (hidden comment: Inductor)
R81  value 0  [RESC1608X05]  (hidden comment: Res 0 Ohm)
R82  value 0  [RESC1608X05]  (hidden comment: Res 0 Ohm)
R83  value 10k  [RESC1608X05]  (hidden comment: Res 10k)
R84  value 10k  [RESC1608X05]  (hidden comment: Res 10k)
R85  value 100k  [RESC1608X05]  (hidden comment: Res 100k)
R86  value 100k  [RESC1608X05]  (hidden comment: Res 100k)
R87  value 0  [RESC1608X05]  (hidden comment: Res 0 Ohm)
R88  value 0  [RESC1608X05]  (hidden comment: Res 0 Ohm)
R89  value 10k  [RESC1608X05]  (hidden comment: Res 10k)
S3  KMR211G-LFS  [C&K_KMR211G]
U12  TPS65217CRSLT  [CRSLT]

### Ports
GND_WLED, PMIC_EXT_WAKEUP, PMIC_EXTINTn, PMIC_I2C1_SCL, PMIC_I2C1_SDA, PMIC_LDO_PGOOD, PMIC_PGOOD, PMIC_PWR_EN, VCC_WLED

### Nets
+1.1V_CORE: C167.1 L7.2 U12.29(VDCDC3)
+1.1V_MPU: C165.1 L6.2 U12.24(VDCDC2)
+1.5V_DDR: C163.1 L5.2 U12.19(VDCDC1)
+1.8V_PMIC: C169.2 U12.40(LS1_OUT)
+1.8V_VLDO1: C174.1 R85.2 R86.2 U12.3(VLDO1) U12.18(VIO)
+3.3V_CORE: R82.2 R83.2 R84.2
+3.3V_VLDO2: C175.1 R89.1 U12.1(VLDO2)
+5V: R81.1
GND: C158.1 C159.1 C160.1 C161.1 C162.1 C163.2 C164.1 C165.2 C166.1 C167.2 C168.1 C169.1 C170.1 C171.1 C172.1 C173.1 C174.2 C175.2 D11.1 R87.1 R88.1 S3.1 S3.3 U12.12(USB) U12.30(PGND) U12.41(AGND) U12.49(PPAD)
EXTINT: R85.1 U12.45(~{INT}) ; port PMIC_EXTINTn
I2C1_SCL: R83.1 U12.28(SCL) ; port PMIC_I2C1_SCL
I2C1_SDA: R84.1 U12.27(SDA) ; port PMIC_I2C1_SDA
LDO_PGOOD: U12.46(LDO_PGOOD) ; port PMIC_LDO_PGOOD
PGOOD: U12.26(PGOOD) ; port PMIC_PGOOD
PWR_EN: U12.9(PWR_EN) ; port PMIC_PWR_EN
SYS: C161.2 C162.2 C164.2 C166.2 C168.2 C170.2 C173.2 L8.1 U12.2(VINLDO) U12.7(SYS1) U12.8(SYS2) U12.21(VIN_DCDC1) U12.22(VIN_DCDC2) U12.32(VIN_DCDC3) U12.39(LS1_IN) U12.42(LS2_IN)
WAKEUP: R86.1 U12.13(~{WAKEUP}) ; port PMIC_EXT_WAKEUP
NetC158_2: C158.2 R81.2 U12.10(AC)
NetC159_2: C159.2 U12.48(INT_LDO)
NetC160_2: C160.2 U12.47(BYPASS)
NetC171_2: C171.2 R82.1 U12.43(LS2_OUT)
NetC172_2: C172.2 D10.2(K) U12.38(FB_WLED) ; port VCC_WLED
NetD10_1: D10.1(A) L8.2 U12.37(L4)
NetD11_2: D11.2 R89.2
NetL5_1: L5.1 U12.20(L1)
NetL6_1: L6.1 U12.23(L2)
NetL7_1: L7.1 U12.31(L3)
NetP8_1: U12.33(ISINK2) U12.34(ISINK1) ; port GND_WLED
NetR87_2: R87.2 U12.35(ISET1)
NetR88_2: R88.2 U12.36(ISET2)
NetS3_2: S3.2 S3.4 U12.25(PB_IN)

Not connected (* = marked no-connect by the designer): U12 4(BAT1)* 5(BAT2)* 6(BAT_SENSE)* 11(TS)* 14(MUX_IN)* 15(NC)* 16(MUX_OUT)* 17(NC)* 44(~{RESET})*

### Notes on the sheet
- (in symbol TPS65217CRSLT) Power Path and Charger; DCDC1; DCDC2; DCDC3; LS1/LDO3; LS2/LDO4; MUX; LDO1; LDO2

### Library data of the parts
C158 C161 = Cap: Capacitor; Fabricant: MURATA; Fournisseur: Farnell; RefFabricant: GRM188R61A226ME15D; RefFournisseur: 2426957; Case: 0603 [1608 Metric]; DataSheet: http://www.farnell.com/datasheets/2047978.pdf
C159 = Cap: Capacitor; RefFournisseur: 2522432; RefFabricant: C0603T104K5RALTU; Fabricant: KEMET; Fournisseur: Farnell; Case: 0603 [1608 Metric]
C160 C162-C168 C170 C174 C175 = Cap: Capacitor; Fournisseur: Farnell; RefFournisseur: 2309028; RefFabricant: C1608X5R1A106M080AC; Fabricant: TDK; Case: 0603 [1608 Metric]; DataSheet: http://www.farnell.com/datasheets/2291921.pdf
C169 C171 = Cap: Capacitor; RefFabricant: GRT188R60J225KE13D; Fabricant: MURATA; Fournisseur: Farnell; RefFournisseur: 2672153; Case: 0603 [1608 Metric]; DataSheet: http://www.farnell.com/datasheets/2165952.pdf
C172 C173 = Cap: Capacitor; Fabricant: MURATA; Fournisseur: Farnell; RefFabricant: GRT188R61E475KE13D; RefFournisseur: 2672159; DataSheet: http://www.farnell.com/datasheets/2165958.pdf; Case: 0603 [1608 Metric]
D10 = D Zener: Zener Diode; RefFabricant: LM4041DIM3-1.2; RefFournisseur: 9778349; Fabricant: TEXAS INSTRUMENTS; Fournisseur: Farnell; DataSheet: http://www.ti.com/lit/ds/symlink/lm4041-n.pdf
D11 = LNJ037X8ARA: LED Blanc; RefFournisseur: 1908051; Fabricant: PANASONIC ELECTRONIC COMPONENTS; Fournisseur: Farnell; RefFabricant: LNJ037X8ARA; DataSheet: http://www.farnell.com/datasheets/2085723.pdf
L5-L7 = Inductor: Fabricant: MURATA; Fournisseur: Farnell; RefFabricant: LQM18NN2R2K00D; RefFournisseur: 1343118; Case: 0603 [1608 Metric]; DataSheet: http://www.farnell.com/datasheets/66032.pdf
L8 = Inductor: Fabricant: TDK; Fournisseur: Farnell; RefFabricant: MLF2012C180K; RefFournisseur: 1669551; Case: 0805 [2012 Metric]; DataSheet: http://www.farnell.com/datasheets/321059.pdf
R81 R82 R87 R88 = Res1: as R1 on sheet P0_Main_Connect; Case: 0603 [1608 Metric]
R83 R84 R89 = Res1: as R7 on sheet PP1_ptA_SRAM-NAND; Case: 0603 [1608 Metric]; DataSheet: CRGH0603J10K
R85 R86 = Res1: Resistor; Fabricant: TE CONNECTIVITY; Fournisseur: Farnell; RefFabricant: RN73C1J100KBTDF; RefFournisseur: 2687850; Case: 0603 [1608 Metric]; DataSheet: http://www.farnell.com/datasheets/2189072.pdf
S3 = KMR211G-LFS: as S2 on sheet PP1_ptA_SRAM-NAND; DataSheet: http://www.farnell.com/datasheets/2044619.pdf
U12 = TPS65217CRSLT: Gestion d'alimentation PMIC; Fabricant: TEXAS INSTRUMENTS; Fournisseur: Farnell; RefFournisseur: 2492485; RefFabricant: TPS65217CRSLT; DataSheet: http://www.ti.com/lit/ds/symlink/tps65217.pdf

## Sheet PP6_LCD.SchDoc
size A3
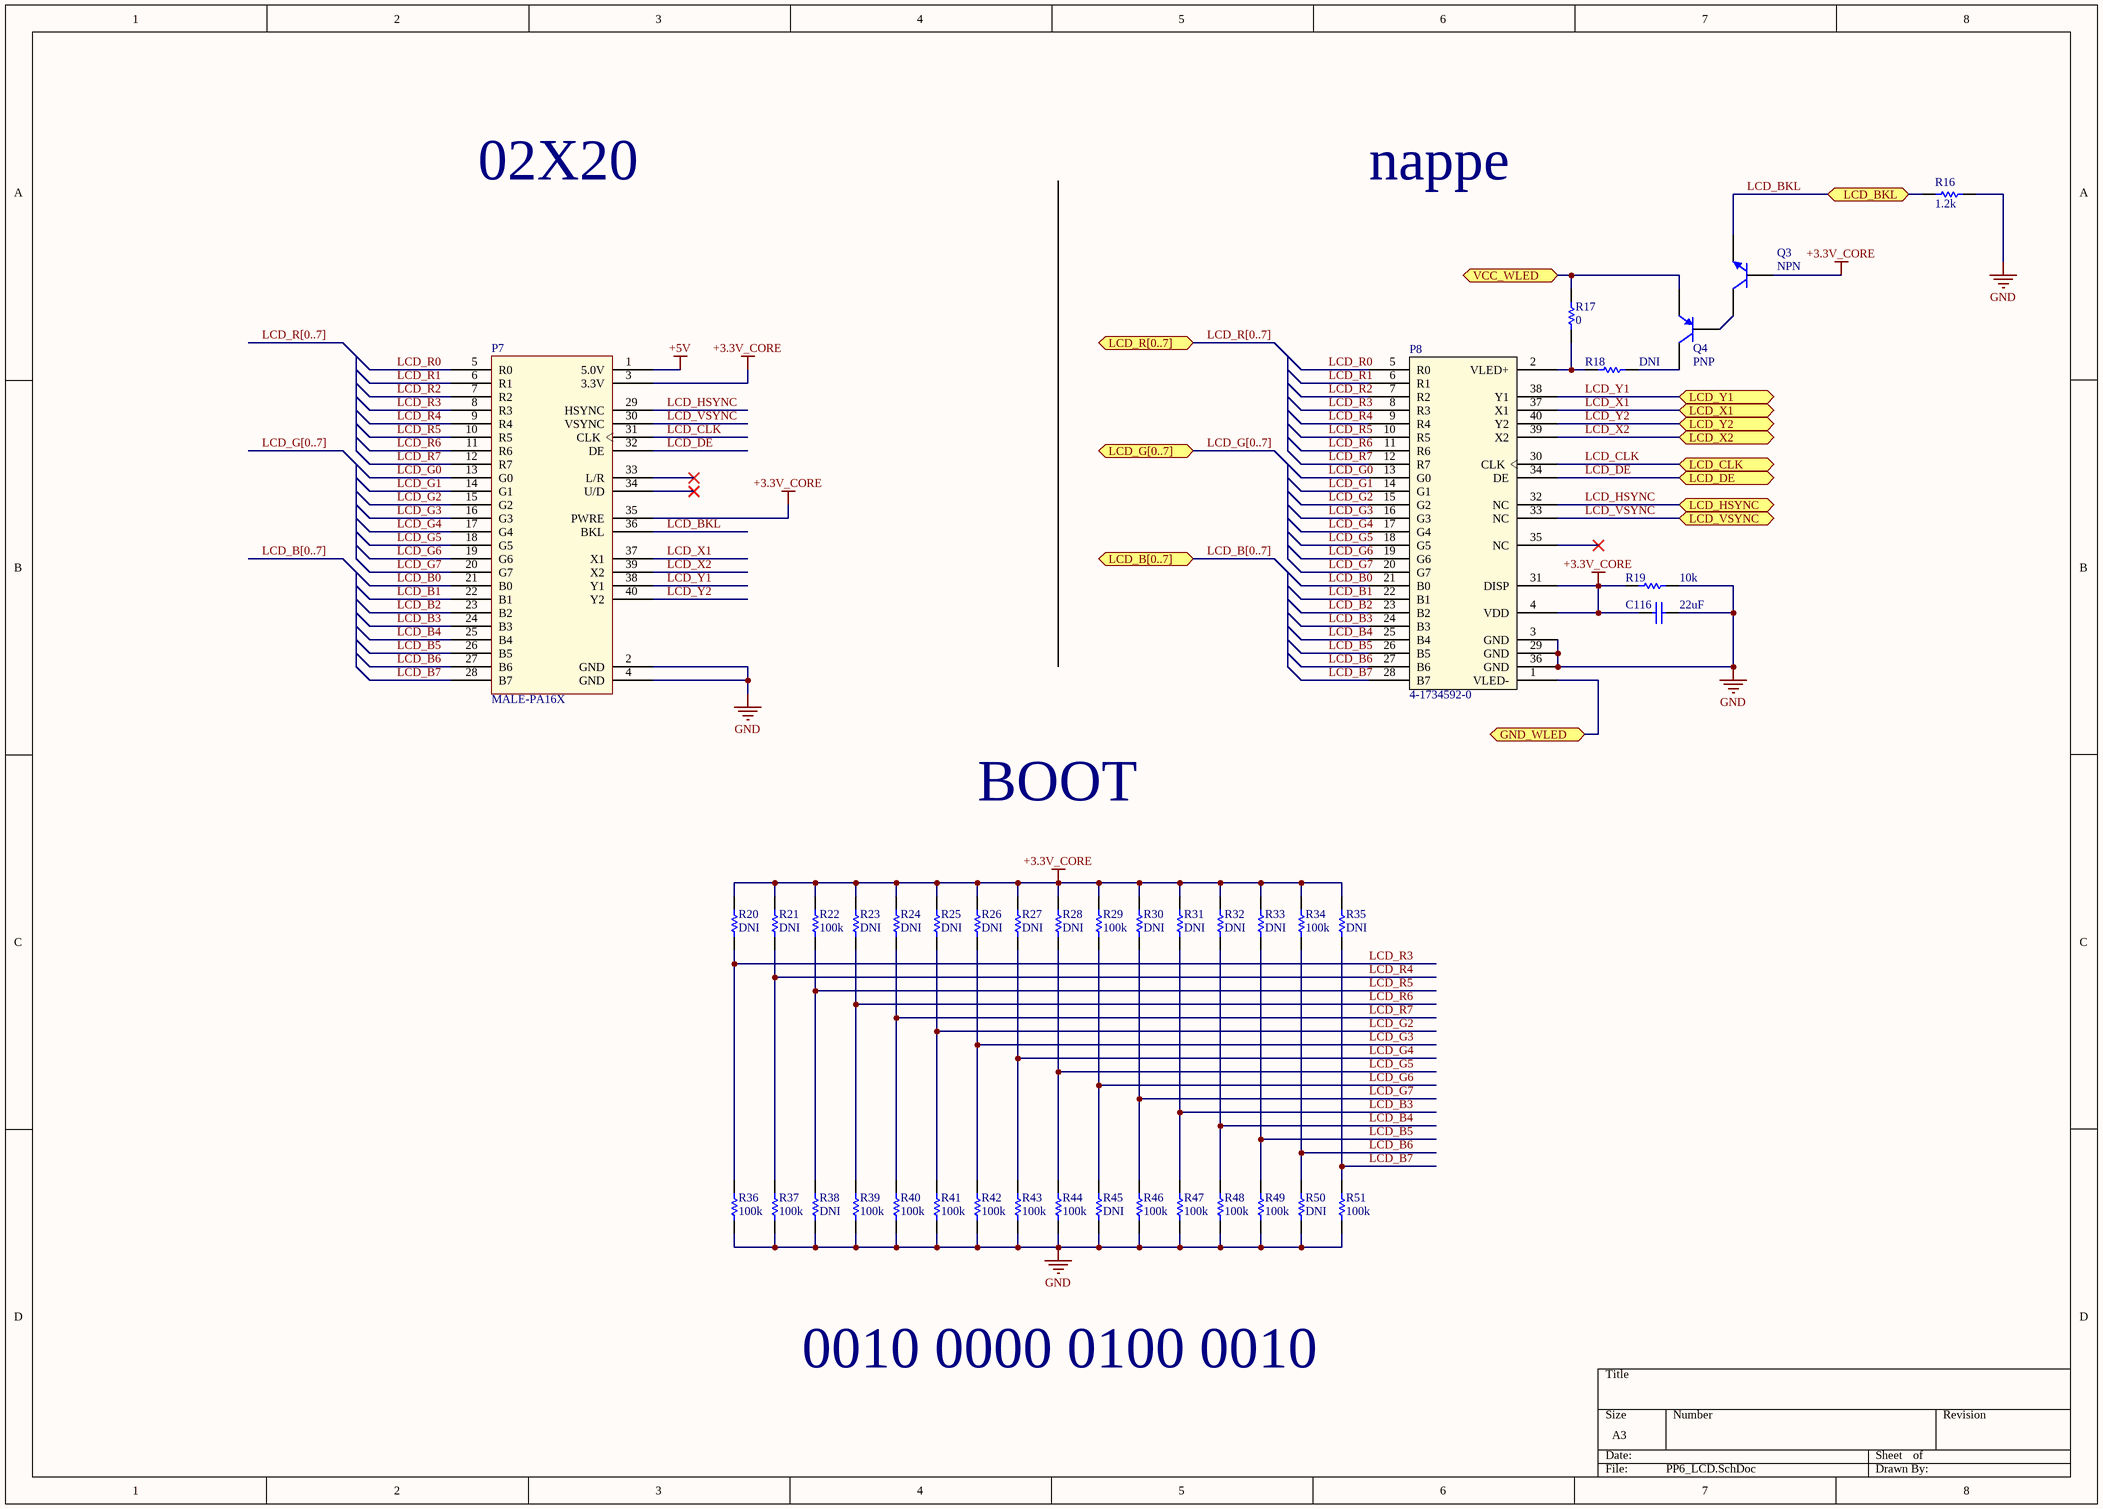
[diagram p4: PP6_LCD.SchDoc]

### Parts
C116  value 22uF  [CAPC1608X08]  (hidden comment: Cap 22uF)
P7  MALE-PA16X  [MALE-PAV16X-2x05]
P8  4-1734592-0  [TE_4-1734592-0]
Q3  NPN  [SOT95P234X111-3N]
Q4  PNP  [SOT95P234X111-3N]
R16  value 1.2k  [RESC1608X05]  (hidden comment: Res 1.2k)
R17  value 0  [RESC1608X05]  (hidden comment: Res 0 Ohm)
R18  value DNI  [RESC1608X05]  (hidden comment: Res)  (no BOM)
R19  value 10k  [RESC1608X05]  (hidden comment: Res 10k)
R20  value DNI  [RESC1608X05]  (hidden comment: Res)  (no BOM)
R21  value DNI  [RESC1608X05]  (hidden comment: Res)  (no BOM)
R22  value 100k  [RESC1608X05]  (hidden comment: Res 100k)
R23  value DNI  [RESC1608X05]  (hidden comment: Res)  (no BOM)
R24  value DNI  [RESC1608X05]  (hidden comment: Res)  (no BOM)
R25  value DNI  [RESC1608X05]  (hidden comment: Res)  (no BOM)
R26  value DNI  [RESC1608X05]  (hidden comment: Res)  (no BOM)
R27  value DNI  [RESC1608X05]  (hidden comment: Res)  (no BOM)
R28  value DNI  [RESC1608X05]  (hidden comment: Res)  (no BOM)
R29  value 100k  [RESC1608X05]  (hidden comment: Res 100k)
R30  value DNI  [RESC1608X05]  (hidden comment: Res)  (no BOM)
R31  value DNI  [RESC1608X05]  (hidden comment: Res)  (no BOM)
R32  value DNI  [RESC1608X05]  (hidden comment: Res)  (no BOM)
R33  value DNI  [RESC1608X05]  (hidden comment: Res)  (no BOM)
R34  value 100k  [RESC1608X05]  (hidden comment: Res 100k)
R35  value DNI  [RESC1608X05]  (hidden comment: Res)  (no BOM)
R36  value 100k  [RESC1608X05]  (hidden comment: Res 100k)
R37  value 100k  [RESC1608X05]  (hidden comment: Res 100k)
R38  value DNI  [RESC1608X05]  (hidden comment: Res)  (no BOM)
R39  value 100k  [RESC1608X05]  (hidden comment: Res 100k)
R40  value 100k  [RESC1608X05]  (hidden comment: Res 100k)
R41  value 100k  [RESC1608X05]  (hidden comment: Res 100k)
R42  value 100k  [RESC1608X05]  (hidden comment: Res 100k)
R43  value 100k  [RESC1608X05]  (hidden comment: Res 100k)
R44  value 100k  [RESC1608X05]  (hidden comment: Res 100k)
R45  value DNI  [RESC1608X05]  (hidden comment: Res)  (no BOM)
R46  value 100k  [RESC1608X05]  (hidden comment: Res 100k)
R47  value 100k  [RESC1608X05]  (hidden comment: Res 100k)
R48  value 100k  [RESC1608X05]  (hidden comment: Res 100k)
R49  value 100k  [RESC1608X05]  (hidden comment: Res 100k)
R50  value DNI  [RESC1608X05]  (hidden comment: Res)  (no BOM)
R51  value 100k  [RESC1608X05]  (hidden comment: Res 100k)

### Ports
GND_WLED, LCD_B[0..7], LCD_BKL, LCD_CLK, LCD_DE, LCD_G[0..7], LCD_HSYNC, LCD_R[0..7], LCD_VSYNC, LCD_X1, LCD_X2, LCD_Y1, LCD_Y2, VCC_WLED

### Nets
+3.3V_CORE: C116.2 P7.3(3.3V) P7.35(PWRE) P8.4(VDD) P8.31(DISP) Q3.2(B) R19.2 R20.2 R21.2 R22.2 R23.2 R24.2 R25.2 R26.2 R27.2 R28.2 R29.2 R30.2 R31.2 R32.2 R33.2 R34.2 R35.2
+5V: P7.1(5.0V)
GND: C116.1 P7.2(GND) P7.4(GND) P8.3(GND) P8.29(GND) P8.36(GND) R16.1 R19.1 R36.1 R37.1 R38.1 R39.1 R40.1 R41.1 R42.1 R43.1 R44.1 R45.1 R46.1 R47.1 R48.1 R49.1 R50.1 R51.1
LCD_B0: P7.21(B0) P8.21(B0)
LCD_B1: P7.22(B1) P8.22(B1)
LCD_B2: P7.23(B2) P8.23(B2)
LCD_B3: P7.24(B3) P8.24(B3) R31.1 R47.2
LCD_B4: P7.25(B4) P8.25(B4) R32.1 R48.2
LCD_B5: P7.26(B5) P8.26(B5) R33.1 R49.2
LCD_B6: P7.27(B6) P8.27(B6) R34.1 R50.2
LCD_B7: P7.28(B7) P8.28(B7) R35.1 R51.2
LCD_BKL: P7.36(BKL) Q3.3(E) R16.2 ; port LCD_BKL
LCD_CLK: P7.31(CLK) P8.30(CLK) ; port LCD_CLK
LCD_DE: P7.32(DE) P8.34(DE) ; port LCD_DE
LCD_G0: P7.13(G0) P8.13(G0)
LCD_G1: P7.14(G1) P8.14(G1)
LCD_G2: P7.15(G2) P8.15(G2) R25.1 R41.2
LCD_G3: P7.16(G3) P8.16(G3) R26.1 R42.2
LCD_G4: P7.17(G4) P8.17(G4) R27.1 R43.2
LCD_G5: P7.18(G5) P8.18(G5) R28.1 R44.2
LCD_G6: P7.19(G6) P8.19(G6) R29.1 R45.2
LCD_G7: P7.20(G7) P8.20(G7) R30.1 R46.2
LCD_HSYNC: P7.29(HSYNC) P8.32(NC) ; port LCD_HSYNC
LCD_R0: P7.5(R0) P8.5(R0)
LCD_R1: P7.6(R1) P8.6(R1)
LCD_R2: P7.7(R2) P8.7(R2)
LCD_R3: P7.8(R3) P8.8(R3) R20.1 R36.2
LCD_R4: P7.9(R4) P8.9(R4) R21.1 R37.2
LCD_R5: P7.10(R5) P8.10(R5) R22.1 R38.2
LCD_R6: P7.11(R6) P8.11(R6) R23.1 R39.2
LCD_R7: P7.12(R7) P8.12(R7) R24.1 R40.2
LCD_VSYNC: P7.30(VSYNC) P8.33(NC) ; port LCD_VSYNC
LCD_X1: P7.37(X1) P8.37(X1) ; port LCD_X1
LCD_X2: P7.39(X2) P8.39(X2) ; port LCD_X2
LCD_Y1: P7.38(Y1) P8.38(Y1) ; port LCD_Y1
LCD_Y2: P7.40(Y2) P8.40(Y2) ; port LCD_Y2
NetC172_2: Q4.3(E) R17.2 ; port VCC_WLED
NetP8_1: P8.1(VLED-) ; port GND_WLED
NetP8_2: P8.2(VLED+) R17.1 R18.2
NetQ3_1: Q3.1(C) Q4.2(B)
NetQ4_1: Q4.1(C) R18.1

Not connected (* = marked no-connect by the designer): P7 33(L/R)* 34(U/D)*; P8 35(NC)*

### Buses and harness runs
bus LCD_B[0..7]
bus LCD_B[0..7] = port LCD_B[0..7]
bus LCD_G[0..7]
bus LCD_G[0..7] = port LCD_G[0..7]
bus LCD_R[0..7]
bus LCD_R[0..7] = port LCD_R[0..7]

### Notes on the sheet
- 02X20
- nappe
- BOOT
- 0010 0000 0100 0010

### Library data of the parts
C116 = Cap: as C158 on sheet PA2_PMIC; Case: 0603 [1608 Metric]; DataSheet: http://www.farnell.com/datasheets/2047978.pdf
P7 = MALE-PA16X: Connecteur LCD et Touch screen (limande); RefFabricant: MALE-PAV16X-2x20; Fournisseur: Olimex; RefFournisseur: MALE-PAV16X-2x20; DataSheet: https://www.olimex.com/Products/Components/Connectors/MALE-PAV16X-2x05/resources/MALE-PA16X-2Xxx.jpg; Fabricant: Olimex
P8 = 4-1734592-0: Connecteur LCD et Touch screen; Fabricant: TE CONNECTIVITY; Fournisseur: Farnell; RefFournisseur: 1816399; RefFabricant: 4-1734592-0; DataSheet: http://www.farnell.com/cad/1794473.pdf
Q3 = NPN: NPN Bipolar Transistor; Fabricant: ON SEMICONDUCTOR; Fournisseur: Farnell; RefFournisseur: 9556672; RefFabricant: SMMUN2214LT1G; DataSheet: http://www.farnell.com/datasheets/1813846.pdf
Q4 = PNP: PNP Bipolar Transistor; RefFabricant: SMMUN2114LT1G; Fabricant: ON SEMICONDUCTOR; RefFournisseur: 2724481; Fournisseur: Farnell; DataSheet: http://www.farnell.com/datasheets/2237089.pdf
R16 = Res1: Resistor; Fabricant: TE CONNECTIVITY; Fournisseur: Farnell; RefFabricant: CPF-A-0603B1K2E1; RefFournisseur: 2483896; Case: 0603 [1608 Metric]; DataSheet: http://www.farnell.com/datasheets/1935020.pdf
R17 = Res1: as R1 on sheet P0_Main_Connect; Case: 0603 [1608 Metric]
R18 R20 R21 R23-R28 R30-R33 R35 R38 R45 R50 = Res1: Resistor; Case: 0603 [1608 Metric]
R19 = Res1: as R7 on sheet PP1_ptA_SRAM-NAND; Case: 0603 [1608 Metric]; DataSheet: CRGH0603J10K
R22 R29 R34 R36 R37 R39-R44 R46-R49 R51 = Res1: as R85 on sheet PA2_PMIC; Case: 0603 [1608 Metric]; DataSheet: http://www.farnell.com/datasheets/2189072.pdf

## Sheet PP3_ptC_Alim.SchDoc
size A3
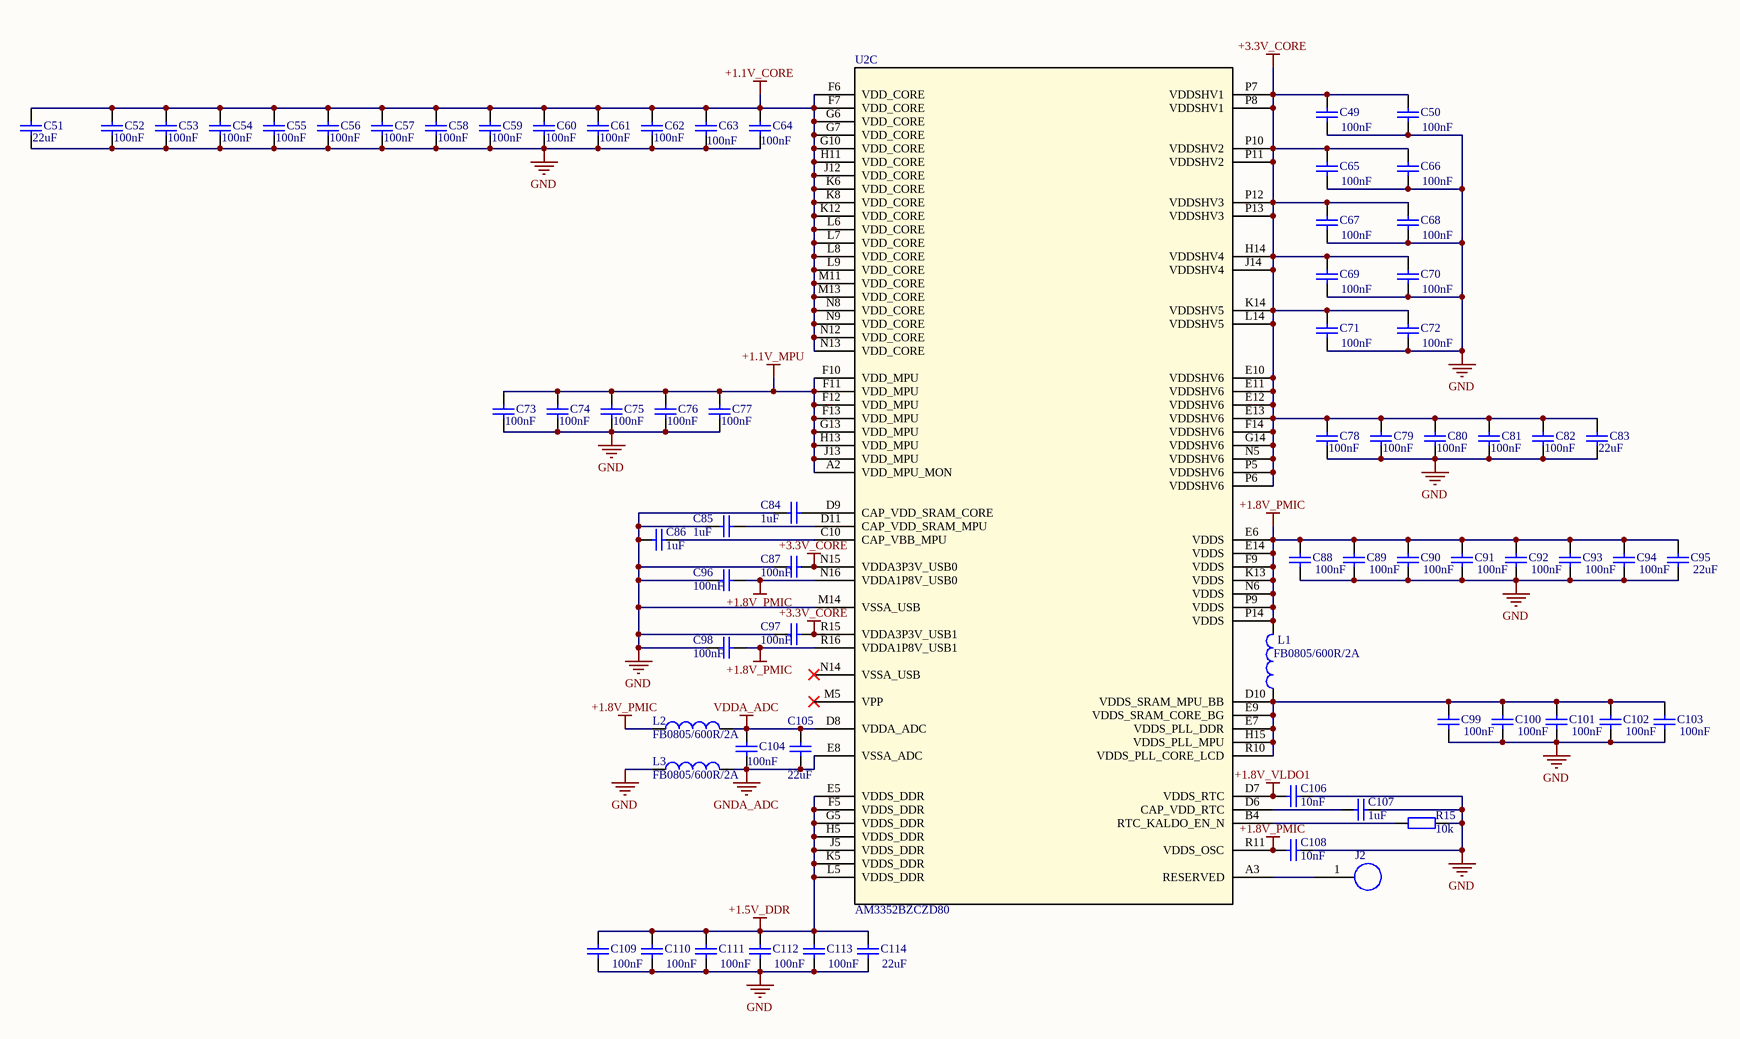
[diagram p5: PP3_ptC_Alim.SchDoc]

### Parts
C49  value 100nF  [CAPC1005X05 (0402)]  (hidden comment: Cap 100nF)
C50  value 100nF  [CAPC1005X05 (0402)]  (hidden comment: Cap 100nF)
C51  value 22uF  [0805 (2012 metric)]  (hidden comment: Cap 22uF)
C52  value 100nF  [CAPC1005X05 (0402)]  (hidden comment: Cap 100nF)
C53  value 100nF  [CAPC1005X05 (0402)]  (hidden comment: Cap 100nF)
C54  value 100nF  [CAPC1005X05 (0402)]  (hidden comment: Cap 100nF)
C55  value 100nF  [CAPC1005X05 (0402)]  (hidden comment: Cap 100nF)
C56  value 100nF  [CAPC1005X05 (0402)]  (hidden comment: Cap 100nF)
C57  value 100nF  [CAPC1005X05 (0402)]  (hidden comment: Cap 100nF)
C58  value 100nF  [CAPC1005X05 (0402)]  (hidden comment: Cap 100nF)
C59  value 100nF  [CAPC1005X05 (0402)]  (hidden comment: Cap 100nF)
C60  value 100nF  [CAPC1005X05 (0402)]  (hidden comment: Cap 100nF)
C61  value 100nF  [CAPC1005X05 (0402)]  (hidden comment: Cap 100nF)
C62  value 100nF  [CAPC1005X05 (0402)]  (hidden comment: Cap 100nF)
C63  value 100nF  [CAPC1005X05 (0402)]  (hidden comment: Cap 100nF)
C64  value 100nF  [CAPC1005X05 (0402)]  (hidden comment: Cap 100nF)
C65  value 100nF  [CAPC1005X05 (0402)]  (hidden comment: Cap 100nF)
C66  value 100nF  [CAPC1005X05 (0402)]  (hidden comment: Cap 100nF)
C67  value 100nF  [CAPC1005X05 (0402)]  (hidden comment: Cap 100nF)
C68  value 100nF  [CAPC1005X05 (0402)]  (hidden comment: Cap 100nF)
C69  value 100nF  [CAPC1005X05 (0402)]  (hidden comment: Cap 100nF)
C70  value 100nF  [CAPC1005X05 (0402)]  (hidden comment: Cap 100nF)
C71  value 100nF  [CAPC1005X05 (0402)]  (hidden comment: Cap 100nF)
C72  value 100nF  [CAPC1005X05 (0402)]  (hidden comment: Cap 100nF)
C73  value 100nF  [CAPC1005X05 (0402)]  (hidden comment: Cap 100nF)
C74  value 100nF  [CAPC1005X05 (0402)]  (hidden comment: Cap 100nF)
C75  value 100nF  [CAPC1005X05 (0402)]  (hidden comment: Cap 100nF)
C76  value 100nF  [CAPC1005X05 (0402)]  (hidden comment: Cap 100nF)
C77  value 100nF  [CAPC1005X05 (0402)]  (hidden comment: Cap 100nF)
C78  value 100nF  [CAPC1005X05 (0402)]  (hidden comment: Cap 100nF)
C79  value 100nF  [CAPC1005X05 (0402)]  (hidden comment: Cap 100nF)
C80  value 100nF  [CAPC1005X05 (0402)]  (hidden comment: Cap 100nF)
C81  value 100nF  [CAPC1005X05 (0402)]  (hidden comment: Cap 100nF)
C82  value 100nF  [CAPC1005X05 (0402)]  (hidden comment: Cap 100nF)
C83  value 22uF  [0805 (2012 metric)]  (hidden comment: Cap 22uF)
C84  value 1uF  [CAPC1608X08]  (hidden comment: Cap 1uF)
C85  value 1uF  [CAPC1608X08]  (hidden comment: Cap 1uF)
C86  value 1uF  [CAPC1608X08]  (hidden comment: Cap 1uF)
C87  value 100nF  [CAPC1005X05 (0402)]  (hidden comment: Cap 100nF)
C88  value 100nF  [CAPC1005X05 (0402)]  (hidden comment: Cap 100nF)
C89  value 100nF  [CAPC1005X05 (0402)]  (hidden comment: Cap 100nF)
C90  value 100nF  [CAPC1005X05 (0402)]  (hidden comment: Cap 100nF)
C91  value 100nF  [CAPC1005X05 (0402)]  (hidden comment: Cap 100nF)
C92  value 100nF  [CAPC1005X05 (0402)]  (hidden comment: Cap 100nF)
C93  value 100nF  [CAPC1005X05 (0402)]  (hidden comment: Cap 100nF)
C94  value 100nF  [CAPC1005X05 (0402)]  (hidden comment: Cap 100nF)
C95  value 22uF  [0805 (2012 metric)]  (hidden comment: Cap 22uF)
C96  value 100nF  [CAPC1005X05 (0402)]  (hidden comment: Cap 100nF)
C97  value 100nF  [CAPC1005X05 (0402)]  (hidden comment: Cap 100nF)
C98  value 100nF  [CAPC1005X05 (0402)]  (hidden comment: Cap 100nF)
C99  value 100nF  [CAPC1005X05 (0402)]  (hidden comment: Cap 100nF)
C100  value 100nF  [CAPC1005X05 (0402)]  (hidden comment: Cap 100nF)
C101  value 100nF  [CAPC1005X05 (0402)]  (hidden comment: Cap 100nF)
C102  value 100nF  [CAPC1005X05 (0402)]  (hidden comment: Cap 100nF)
C103  value 100nF  [CAPC1005X05 (0402)]  (hidden comment: Cap 100nF)
C104  value 100nF  [CAPC1005X05 (0402)]  (hidden comment: Cap 100nF)
C105  value 22uF  [0805 (2012 metric)]  (hidden comment: Cap 22uF)
C106  value 10nF  [CAPC1005X05 (0402)]  (hidden comment: Cap 10uF)
C107  value 1uF  [CAPC1608X08]  (hidden comment: Cap 1uF)
C108  value 10nF  [CAPC1005X05 (0402)]  (hidden comment: Cap 10uF)
C109  value 100nF  [CAPC1005X05 (0402)]  (hidden comment: Cap 100nF)
C110  value 100nF  [CAPC1005X05 (0402)]  (hidden comment: Cap 100nF)
C111  value 100nF  [CAPC1005X05 (0402)]  (hidden comment: Cap 100nF)
C112  value 100nF  [CAPC1005X05 (0402)]  (hidden comment: Cap 100nF)
C113  value 100nF  [CAPC1005X05 (0402)]  (hidden comment: Cap 100nF)
C114  value 22uF  [0805 (2012 metric)]  (hidden comment: Cap 22uF)
J2  Pad traversant  [Pad]  (value not drawn)  (no BOM)
L1  FB0805/600R/2A  [IND2012X8]
L2  FB0805/600R/2A  [IND2012X8]
L3  FB0805/600R/2A  [IND2012X8]
R15  value 10k  [RESC1608X05]  (hidden comment: Res 10k)
U2  AM3352BZCZD80  [ZCZ324]  (part C of 4)

### Nets
+1.1V_CORE: C51.2 C52.1 C53.1 C54.1 C55.1 C56.1 C57.1 C58.1 C59.1 C60.1 C61.1 C62.1 C63.1 C64.1 U2.F6(VDD_CORE) U2.F7(VDD_CORE) U2.G6(VDD_CORE) U2.G7(VDD_CORE) U2.G10(VDD_CORE) U2.H11(VDD_CORE) U2.J12(VDD_CORE) U2.K6(VDD_CORE) U2.K8(VDD_CORE) U2.K12(VDD_CORE) U2.L6(VDD_CORE) U2.L7(VDD_CORE) U2.L8(VDD_CORE) U2.L9(VDD_CORE) U2.M11(VDD_CORE) U2.M13(VDD_CORE) U2.N8(VDD_CORE) U2.N9(VDD_CORE) U2.N12(VDD_CORE) U2.N13(VDD_CORE)
+1.1V_MPU: C73.1 C74.1 C75.1 C76.1 C77.1 U2.A2(VDD_MPU_MON) U2.F10(VDD_MPU) U2.F11(VDD_MPU) U2.F12(VDD_MPU) U2.F13(VDD_MPU) U2.G13(VDD_MPU) U2.H13(VDD_MPU) U2.J13(VDD_MPU)
+1.5V_DDR: C109.1 C110.1 C111.1 C112.1 C113.1 C114.2 U2.E5(VDDS_DDR) U2.F5(VDDS_DDR) U2.G5(VDDS_DDR) U2.H5(VDDS_DDR) U2.J5(VDDS_DDR) U2.K5(VDDS_DDR) U2.L5(VDDS_DDR)
+1.8V_PMIC: C88.1 C89.1 C90.1 C91.1 C92.1 C93.1 C94.1 C95.2 C96.2 C98.2 C108.2 L1.2 L2.1 U2.E6(VDDS) U2.E14(VDDS) U2.F9(VDDS) U2.K13(VDDS) U2.N6(VDDS) U2.N16(VDDA1P8V_USB0) U2.P9(VDDS) U2.P14(VDDS) U2.R11(VDDS_OSC) U2.R16(VDDA1P8V_USB1)
+1.8V_VLDO1: C106.2 U2.D7(VDDS_RTC)
+3.3V_CORE: C49.1 C50.1 C65.1 C66.1 C67.1 C68.1 C69.1 C70.1 C71.1 C72.1 C78.1 C79.1 C80.1 C81.1 C82.1 C83.2 C87.2 C97.2 U2.E10(VDDSHV6) U2.E11(VDDSHV6) U2.E12(VDDSHV6) U2.E13(VDDSHV6) U2.F14(VDDSHV6) U2.G14(VDDSHV6) U2.H14(VDDSHV4) U2.J14(VDDSHV4) U2.K14(VDDSHV5) U2.L14(VDDSHV5) U2.N5(VDDSHV6) U2.N15(VDDA3P3V_USB0) U2.P5(VDDSHV6) U2.P6(VDDSHV6) U2.P7(VDDSHV1) U2.P8(VDDSHV1) U2.P10(VDDSHV2) U2.P11(VDDSHV2) U2.P12(VDDSHV3) U2.P13(VDDSHV3) U2.R15(VDDA3P3V_USB1)
GND: C49.2 C50.2 C51.1 C52.2 C53.2 C54.2 C55.2 C56.2 C57.2 C58.2 C59.2 C60.2 C61.2 C62.2 C63.2 C64.2 C65.2 C66.2 C67.2 C68.2 C69.2 C70.2 C71.2 C72.2 C73.2 C74.2 C75.2 C76.2 C77.2 C78.2 C79.2 C80.2 C81.2 C82.2 C83.1 C84.1 C85.1 C86.1 C87.1 C88.2 C89.2 C90.2 C91.2 C92.2 C93.2 C94.2 C95.1 C96.1 C97.1 C98.1 C99.2 C100.2 C101.2 C102.2 C103.2 C106.1 C107.2 C108.1 C109.2 C110.2 C111.2 C112.2 C113.2 C114.1 L3.1 R15.1 U2.M14(VSSA_USB)
GNDA_ADC: C104.2 C105.1 L3.2 U2.E8(VSSA_ADC)
VDDA_ADC: C104.1 C105.2 L2.2 U2.D8(VDDA_ADC)
NetC84_2: C84.2 U2.D9(CAP_VDD_SRAM_CORE)
NetC85_2: C85.2 U2.D11(CAP_VDD_SRAM_MPU)
NetC86_2: C86.2 U2.C10(CAP_VBB_MPU)
NetC99_1: C99.1 C100.1 C101.1 C102.1 C103.1 L1.1 U2.D10(VDDS_SRAM_MPU_BB) U2.E7(VDDS_PLL_DDR) U2.E9(VDDS_SRAM_CORE_BG) U2.H15(VDDS_PLL_MPU) U2.R10(VDDS_PLL_CORE_LCD)
NetC107_1: C107.1 U2.D6(CAP_VDD_RTC)
NetJ2_1: J2.1(PAD) U2.A3(RESERVED)
NetR15_2: R15.2 U2.B4(RTC_KALDO_EN_N)

Not connected (* = marked no-connect by the designer): U2 M5(VPP)* N14(VSSA_USB)*

### Library data of the parts
C49 C50 C52-C82 C87-C94 C96-C104 C109-C113 = Cap: as C14 on sheet PP1_ptA_SRAM-NAND; Case: 0402 [1005 Metric]; DataSheet: http://www.farnell.com/datasheets/2117933.pdf
C51 C83 C95 C105 C114 = Cap: Capacitor; Fabricant: TDK; Fournisseur: Farnell; RefFabricant: C2012X5R0J226K125AB; RefFournisseur: 2525125; Case: 0805 [2012 Metric]; DataSheet: http://www.farnell.com/datasheets/2291921.pdf
C84-C86 C107 = Cap: as C13 on sheet PP1_ptA_SRAM-NAND; Case: 0603 [1608 Metric]; DataSheet: http://www.farnell.com/datasheets/2048756.pdf
C106 C108 = Cap: as C47 on sheet PP2_ptB; Case: 0402 [1005 Metric]; DataSheet: http://www.farnell.com/datasheets/1936795.pdf
J2 = Pad
L1-L3 = Inductor: Fabricant: TDK; Fournisseur: Farnell; RefFabricant: MPZ2012S601A; RefFournisseur: 1669753; Case: 0805 [2012 Metric]; DataSheet: http://www.farnell.com/datasheets/84904.pdf
  L1: Value: FB0805/600R/2A
R15 = Res2: as R3 on sheet PP1_ptA_SRAM-NAND; Case: 0603 [1608 Metric]; DataSheet: CRGH0603J10K
U2 = AM3352BZCZD80: as U2 on sheet PP1_ptA_SRAM-NAND; RefFournisseur: AM3352ZCZD72; DataSheet: http://www.ti.com/lit/ds/symlink/am3352.pdf